# EAGLE design synth-a-phone-v1.2 (EAGLE 5.11)
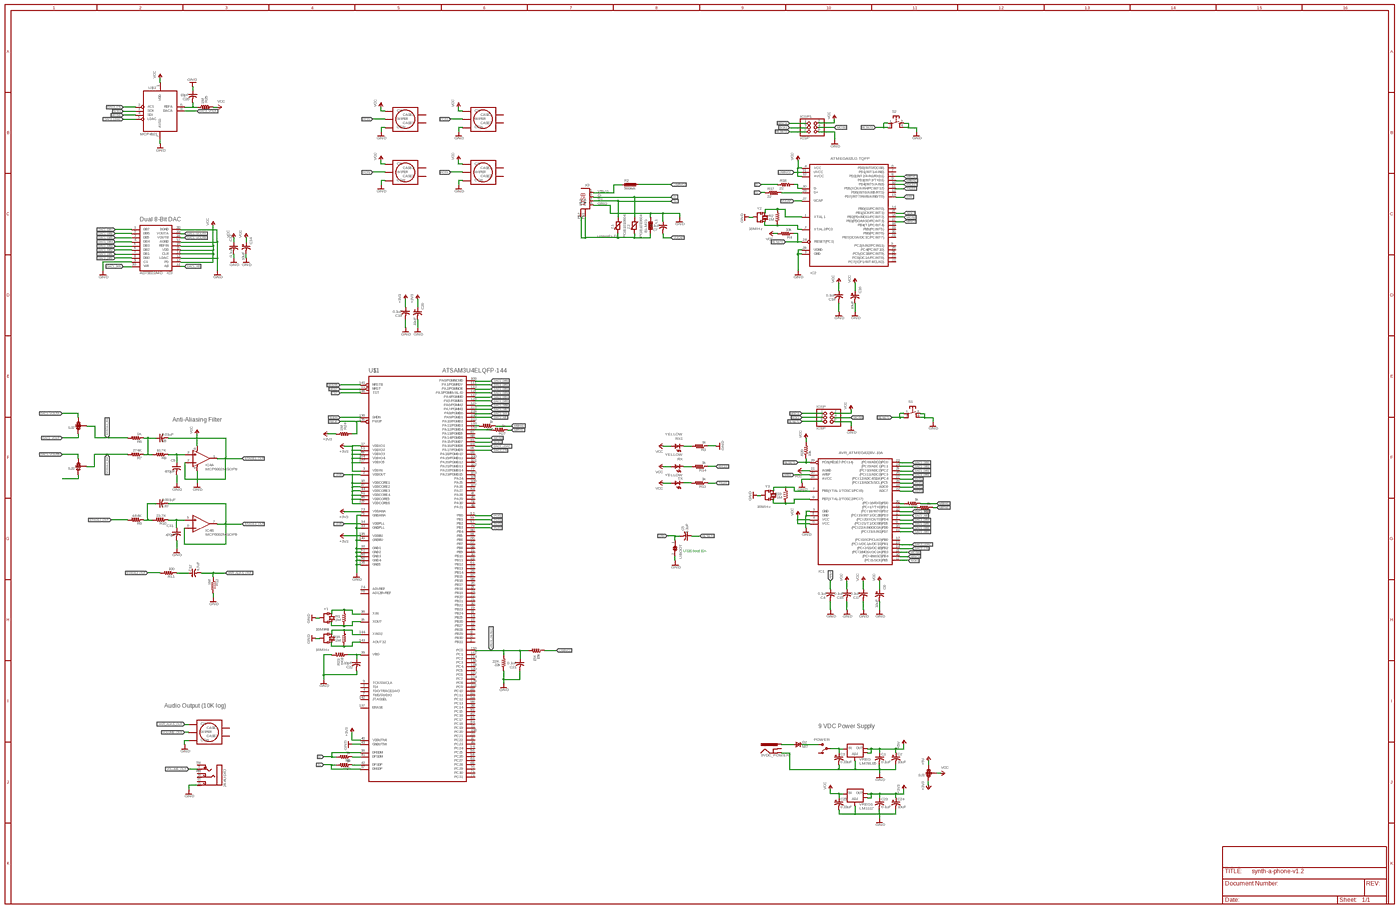
[diagram p0: schematic, sheet 1, overview]
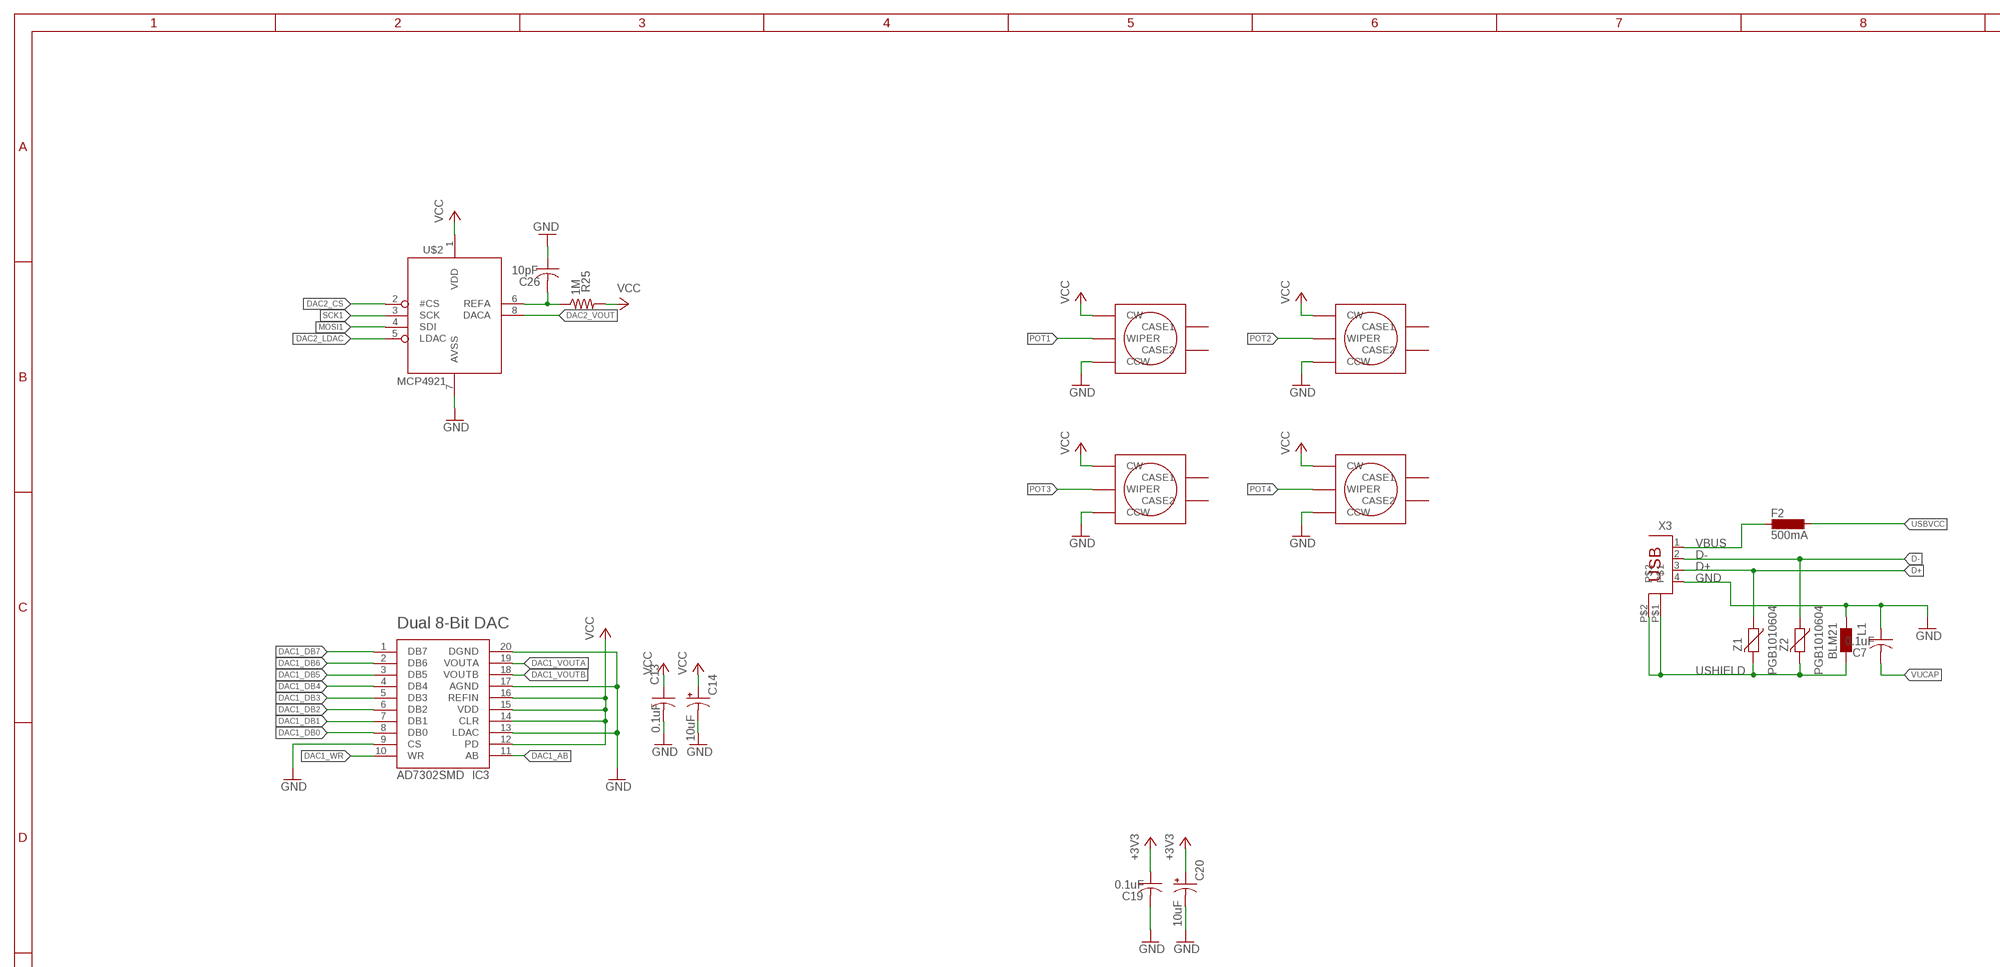
[diagram p1: schematic, sheet 1, part 1 of 4]
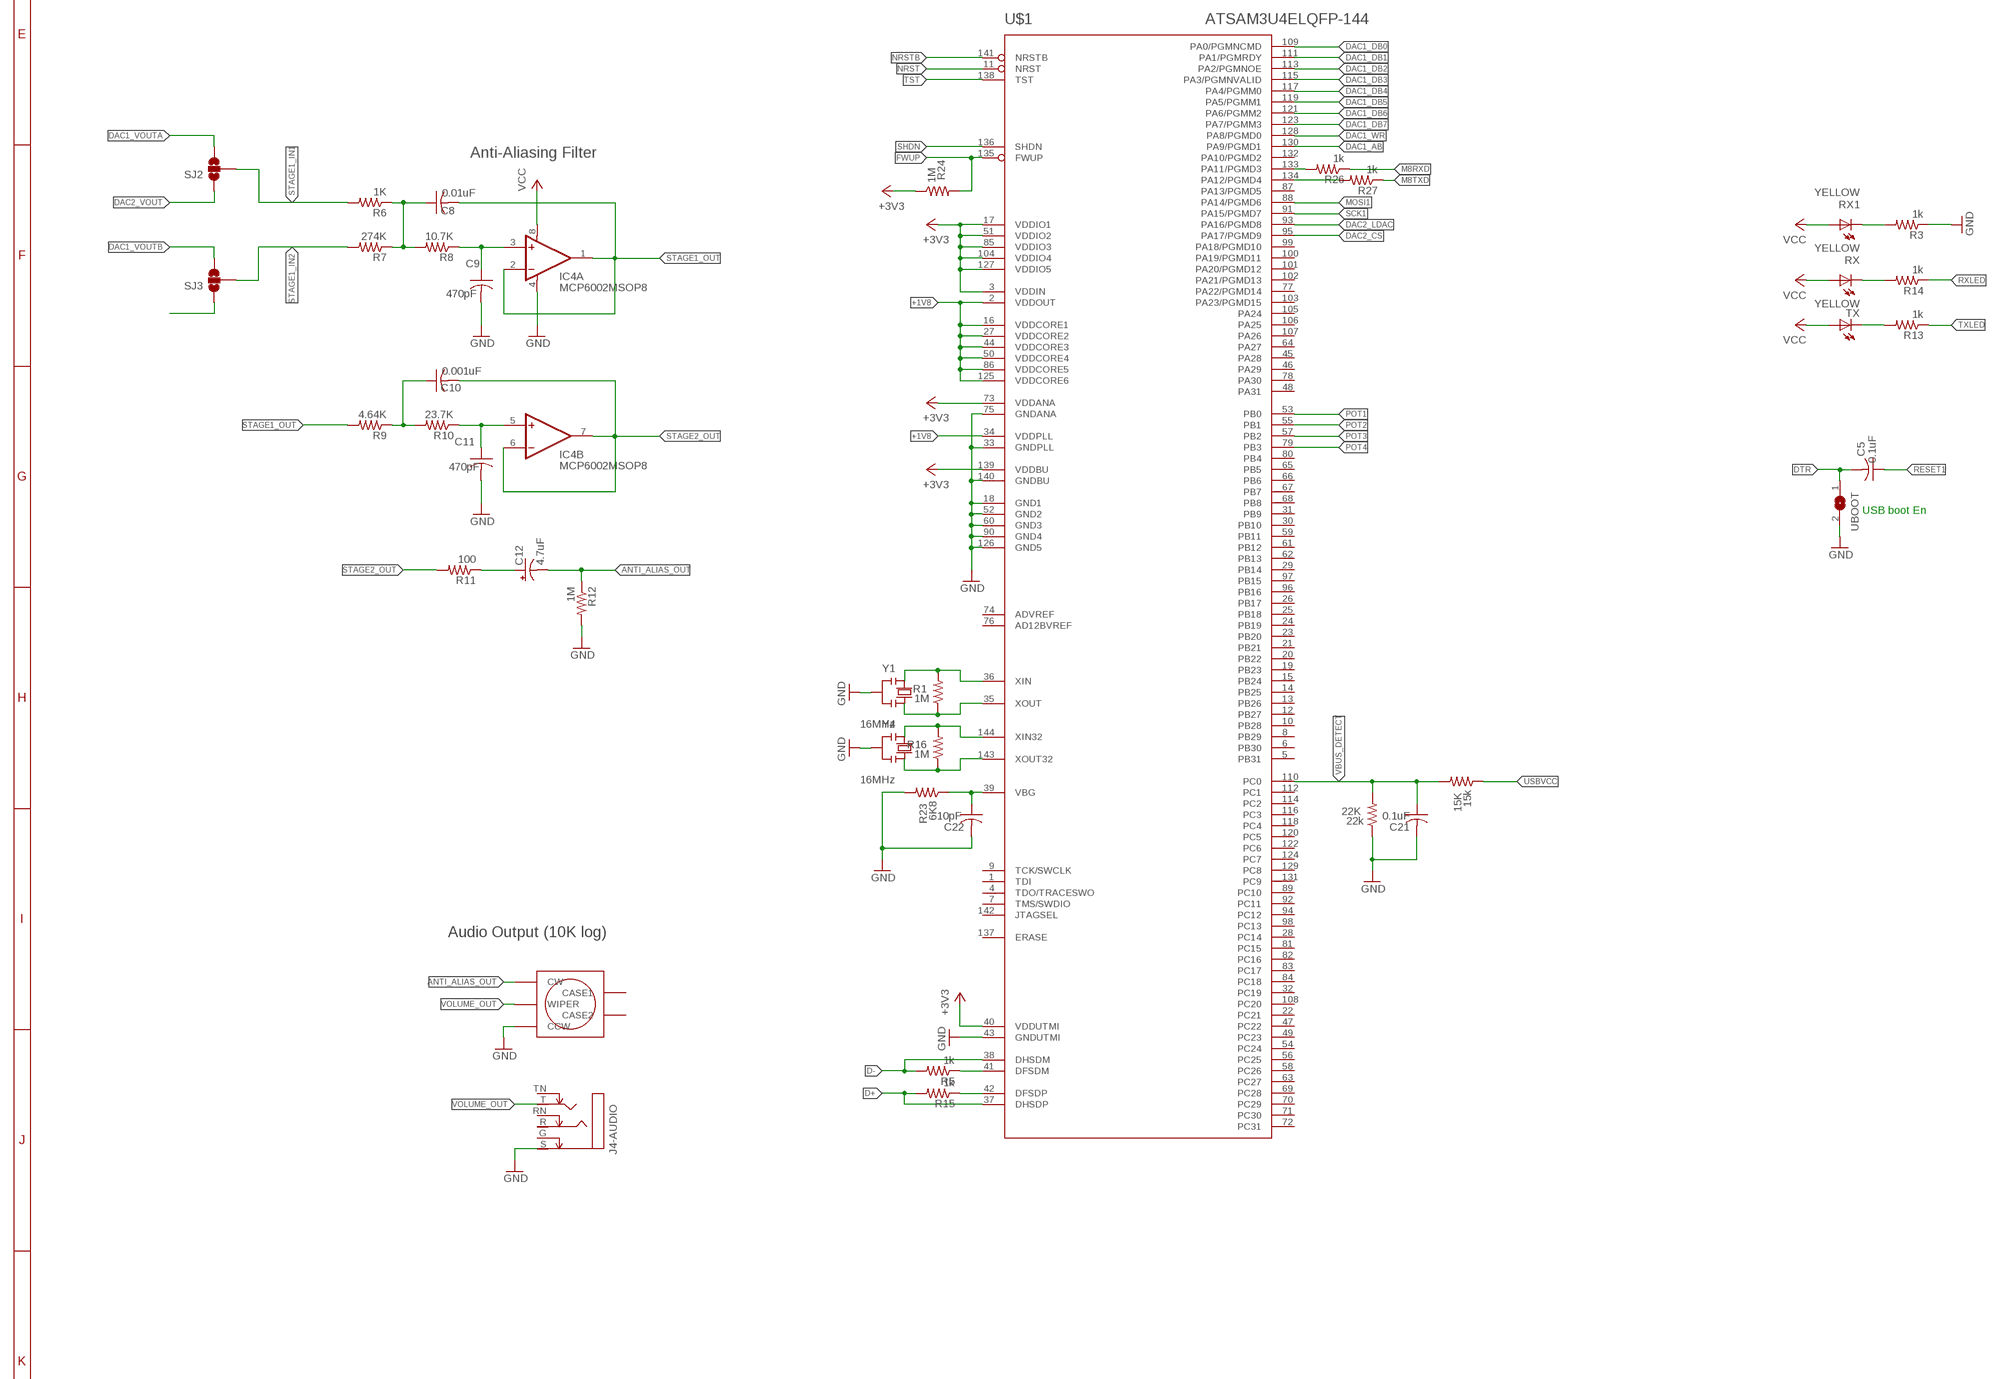
[diagram p2: schematic, sheet 1, part 2 of 4]
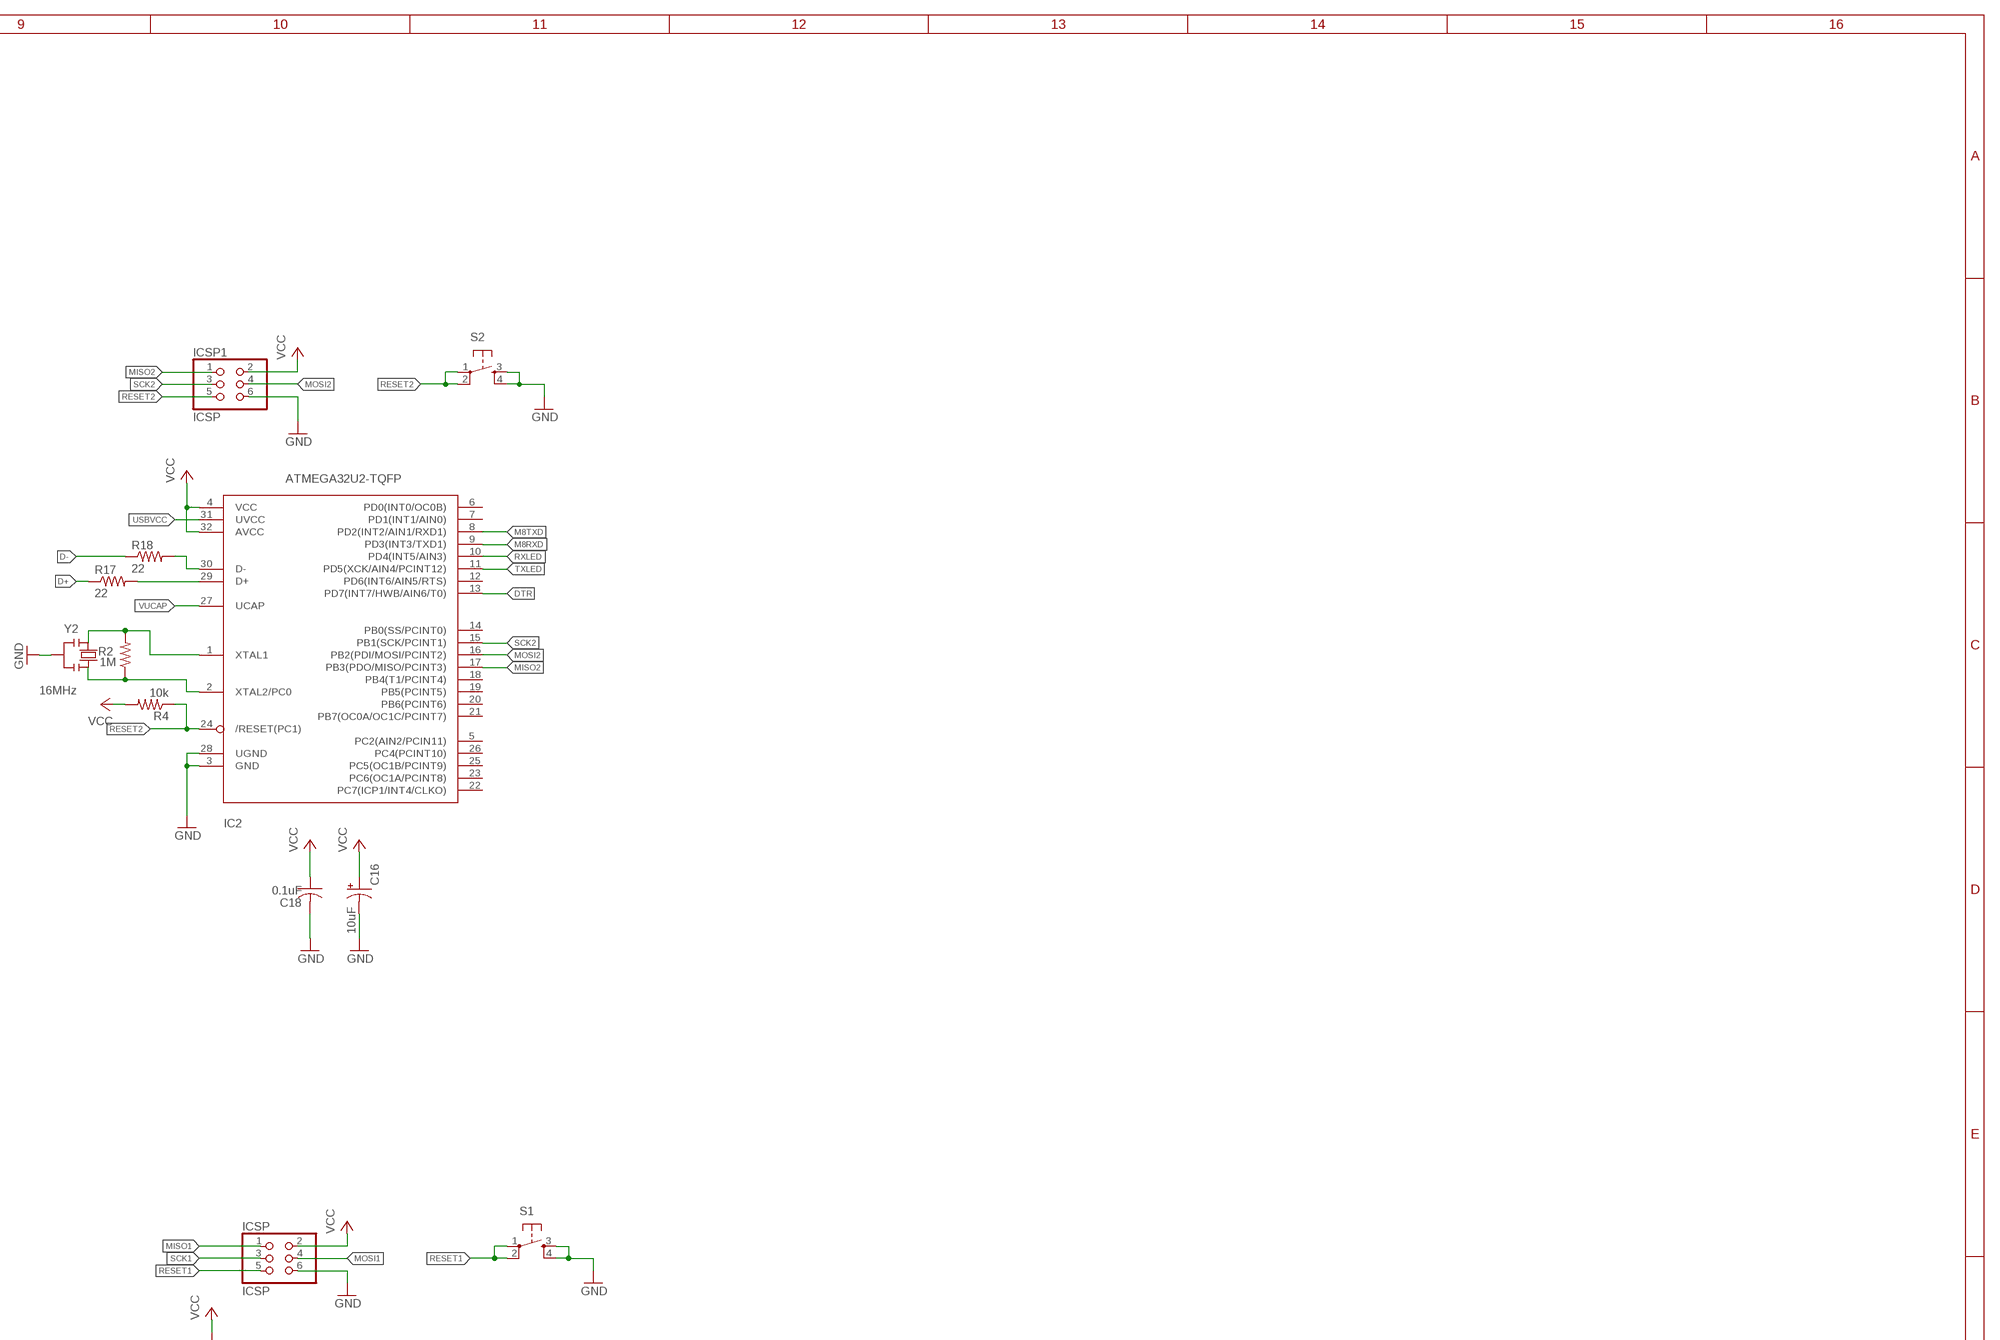
[diagram p3: schematic, sheet 1, part 3 of 4]
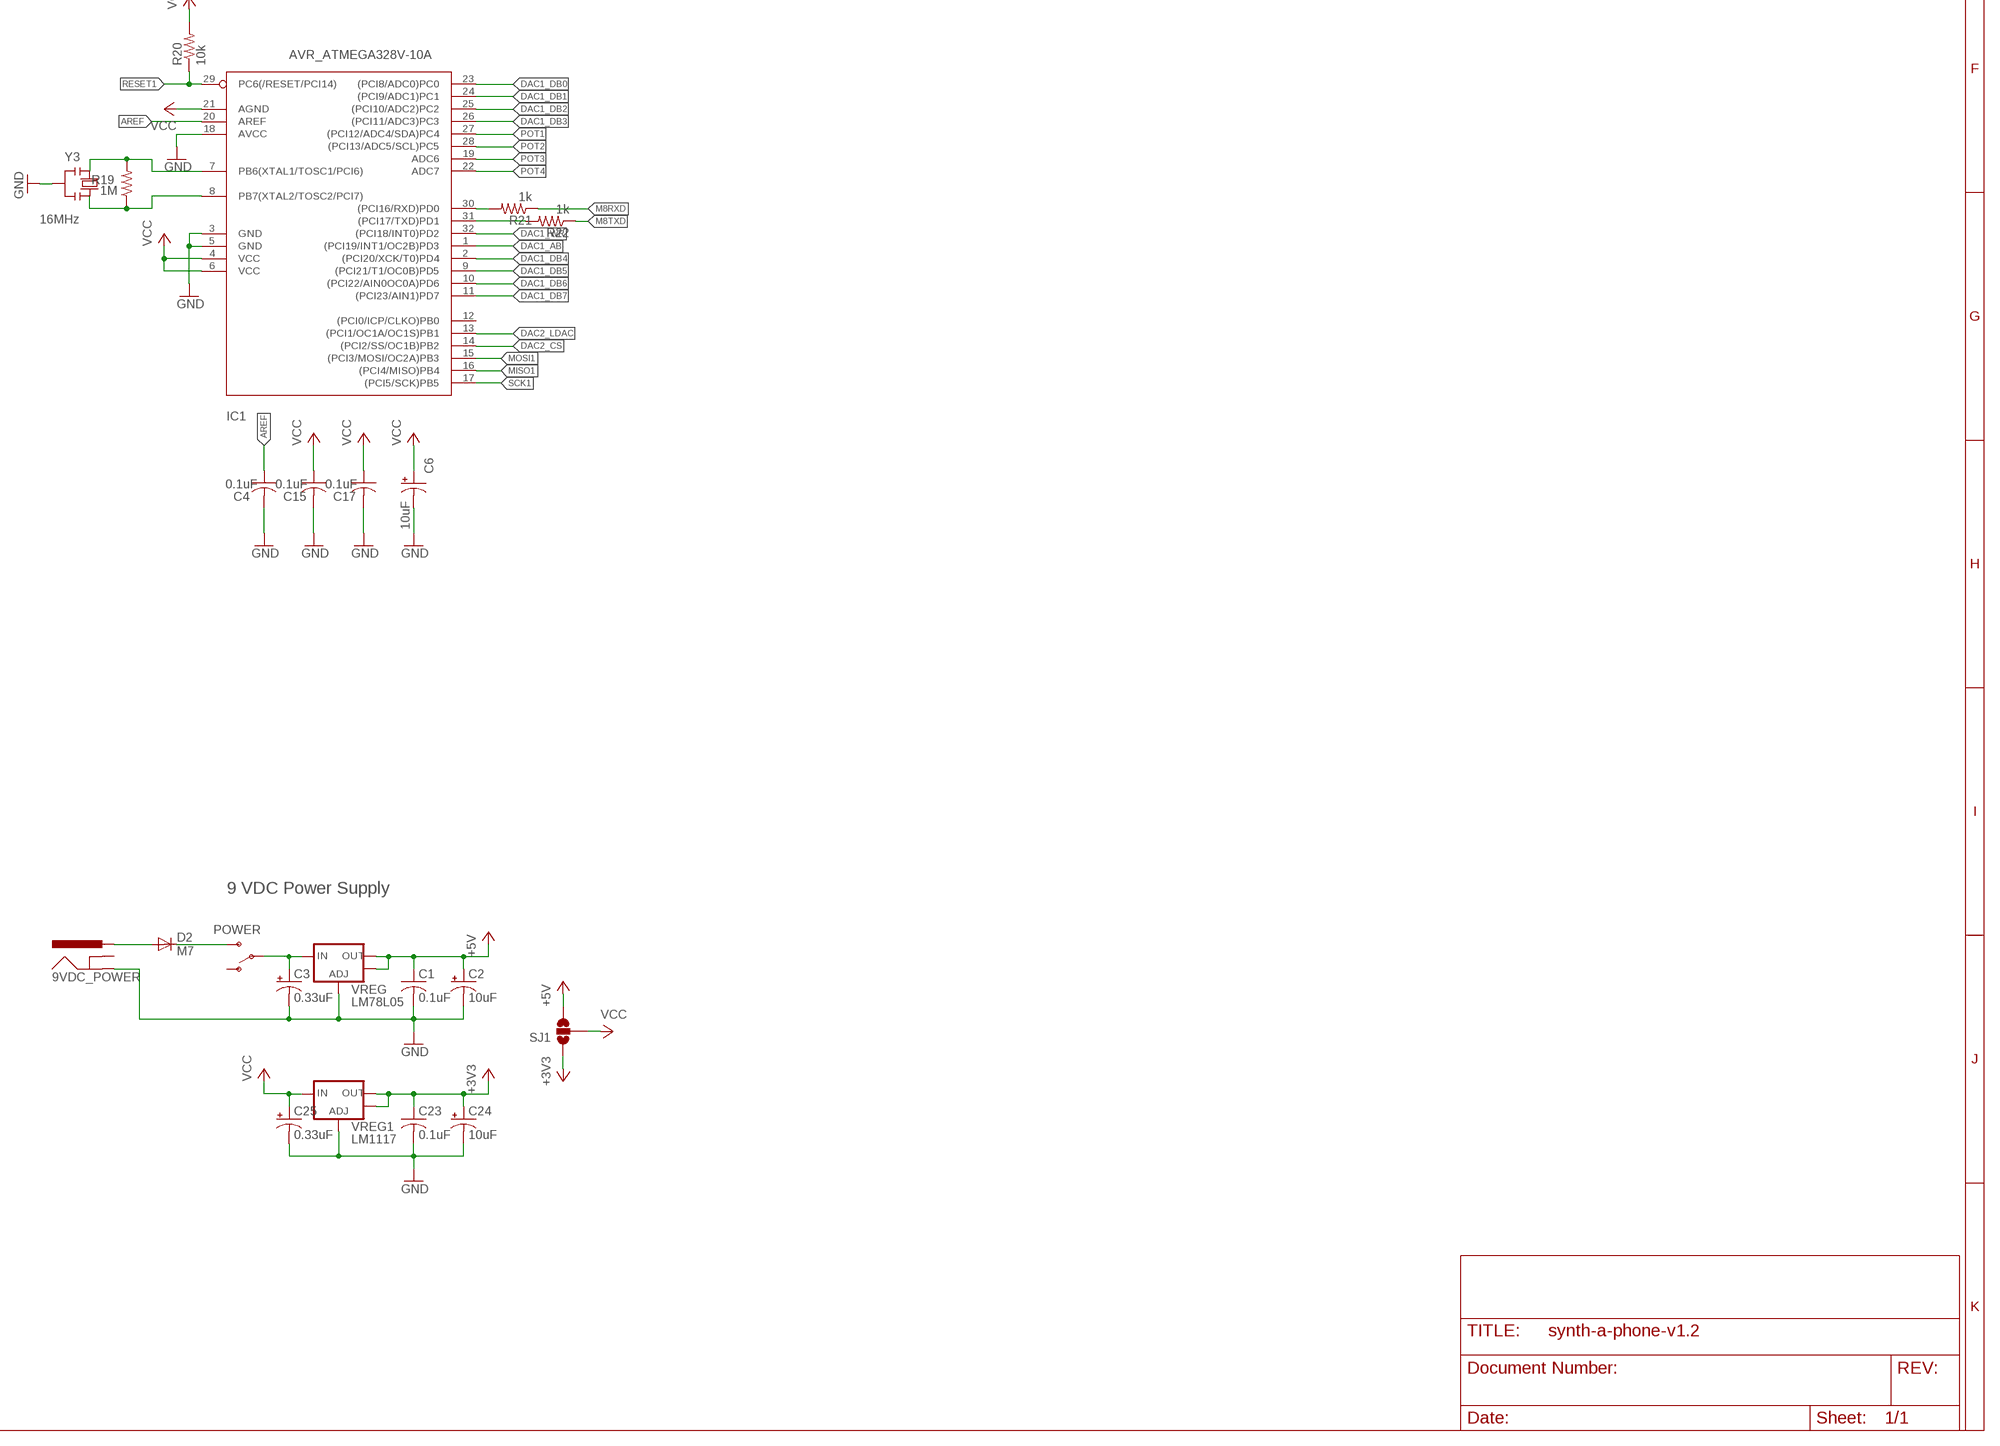
[diagram p4: schematic, sheet 1, part 4 of 4]

## Parts
9VDC_POWER  POWER_JACKPTH  [POWER_JACK_PTH]
15K  15k  R-US_R0603  [R0603]
22K  22k  R-US_R0603  [R0603]
C1  0.1uF  C-USC0603  [C0603]
C2  10uF  CPOL-USSMCA  [SMC_A]
C3  0.33uF  CPOL-USSMCA  [SMC_A]
C4  0.1uF  C-USC0603  [C0603]
C5  0.1uF  C-USC0603  [C0603]
C6  10uF  CPOL-USSMCA  [SMC_A]
C7  0.1uF  C-USC0603  [C0603]
C8  0.01uF  C-USC0603  [C0603]
C9  470pF  C-USC0603  [C0603]
C10  0.001uF  C-USC0603  [C0603]
C11  470pF  C-USC0603  [C0603]
C12  4.7uF  CPOL-USSMCA  [SMC_A]
C13  0.1uF  C-USC0603  [C0603]
C14  10uF  CPOL-USSMCA  [SMC_A]
C15  0.1uF  C-USC0603  [C0603]
C16  10uF  CPOL-USSMCA  [SMC_A]
C17  0.1uF  C-USC0603  [C0603]
C18  0.1uF  C-USC0603  [C0603]
C19  0.1uF  C-USC0603  [C0603]
C20  10uF  CPOL-USSMCA  [SMC_A]
C21  0.1uF  C-USC0603  [C0603]
C22  10pF  C-USC0603  [C0603]
C23  0.1uF  C-USC0603  [C0603]
C24  10uF  CPOL-USSMCA  [SMC_A]
C25  0.33uF  CPOL-USSMCA  [SMC_A]
C26  10pF  C-USC0603  [C0603]
D2  M7  DIODE-SMB  [SMB]
F2  500mA  L-EUL1812  [L1812]
IC1  AVR_ATMEGA328V-10A  [AVR_TQFP32-08]
IC2  ATMEGA32U2-TQFP  [TQFP32-08]
IC3  AD7302SMD  [TSSOP20]
IC4  MCP6002MSOP8  [MSOP8]
ICSP  ICSP  PINHD-2X3  [2X03]
ICSP1  ICSP  PINHD-2X3  [2X03]
J4-AUDIO  STEREOSWL  [NRJ6HF-1]
L1  BLM21  WE-CBF_0805  [0805]
POWER  SPST  SWITCH-SPSTPTH  [SWITCH-SPDT]
R1  1M  R-US_R0603  [R0603]
R2  1M  R-US_R0603  [R0603]
R3  1k  R-US_R0603  [R0603]
R4  10k  R-US_R0603  [R0603]
R5  1k  R-US_R0603  [R0603]
R6  1K  R-US_R0603  [R0603]
R7  274K  R-US_R0603  [R0603]
R8  10.7K  R-US_R0603  [R0603]
R9  4.64K  R-US_R0603  [R0603]
R10  23.7K  R-US_R0603  [R0603]
R11  100  R-US_R0603  [R0603]
R12  1M  R-US_R0603  [R0603]
R13  1k  R-US_R0603  [R0603]
R14  1k  R-US_R0603  [R0603]
R15  1k  R-US_R0603  [R0603]
R16  1M  R-US_R0603  [R0603]
R17  22  R-US_R0603  [R0603]
R18  22  R-US_R0603  [R0603]
R19  1M  R-US_R0603  [R0603]
R20  10k  R-US_R0603  [R0603]
R21  1k  R-US_R0603  [R0603]
R22  1k  R-US_R0603  [R0603]
R23  6K8  R-US_R0603  [R0603]
R24  1M  R-US_R0603  [R0603]
R25  1M  R-US_R0603  [R0603]
R26  1k  R-US_R0603  [R0603]
R27  1k  R-US_R0603  [R0603]
RX  YELLOW  LEDCHIP-LED0805  [CHIP-LED0805]
RX1  YELLOW  LEDCHIP-LED0805  [CHIP-LED0805]
S1  TAC_SWITCHPTH  [TACTILE-PTH]
S2  TAC_SWITCHPTH  [TACTILE-PTH]
SJ1  SOLDERJUMPER_2WAYS  [SJ_3]
SJ2  SOLDERJUMPER_2WAYS  [SJ_3]
SJ3  SOLDERJUMPER_2WAYS  [SJ_3]
TX  YELLOW  LEDCHIP-LED0805  [CHIP-LED0805]
U$1  ATSAM3U4ELQFP-144  [SQFP-S-20X20-144]
U$2  MCP4921MSOP8  [MSOP8]
UBOOT  SJ  [SJ]
VOLUME  Volume  VACOLOCO_EVUFRK09_POT  [VACOLOCO_EVUF]
VOLUME1  Volume  VACOLOCO_EVUFRK09_POT  [VACOLOCO_EVUF]
VOLUME2  Volume  VACOLOCO_EVUFRK09_POT  [VACOLOCO_EVUF]
VOLUME3  Volume  VACOLOCO_EVUFRK09_POT  [VACOLOCO_EVUF]
VOLUME4  Volume  VACOLOCO_EVUFRK09_POT  [VACOLOCO_EVUF]
VREG  LM78L05  V_REG_LM1117SOT223  [SOT223]
VREG1  LM1117  V_REG_LM1117SOT223  [SOT223]
X3  PN61729  [PN61729]
Y1  16MHz  RESONATORMU  [RESONATOR]
Y2  16MHz  RESONATORMU  [RESONATOR]
Y3  16MHz  RESONATORMU  [RESONATOR]
Y4  16MHz  RESONATORMU  [RESONATOR]
Z1  PGB1010604  VARISTORCN0603  [CT/CN0603]
Z2  PGB1010604  VARISTORCN0603  [CT/CN0603]

## Nets
+1V8: U$1.2(VDDOUT) U$1.16(VDDCORE1) U$1.27(VDDCORE2) U$1.34(VDDPLL) U$1.44(VDDCORE3) U$1.50(VDDCORE4) U$1.86(VDDCORE5) U$1.125(VDDCORE6)
+3V3: C19.1 C20.+ C23.1 C24.+ R24.1 SJ1.1 U$1.3(VDDIN) U$1.17(VDDIO1) U$1.40(VDDUTMI) U$1.51(VDDIO2) U$1.73(VDDANA) U$1.85(VDDIO3) U$1.104(VDDIO4) U$1.127(VDDIO5) U$1.139(VDDBU) VREG1.2(OUT) VREG1.4(OUT)
+5V: C1.1 C2.+ SJ1.3 VREG.2(OUT) VREG.4(OUT)
ANTI_ALIAS_OUT: C12.- R12.1 VOLUME.CW
AREF: C4.1 IC1.20(AREF)
D+: R15.2 R17.1 U$1.37(DHSDP) X3.3 Z1.1
D-: R5.2 R18.1 U$1.38(DHSDM) X3.2 Z2.1
DAC1_AB: IC1.1((PCI19/INT1/OC2B)PD3) IC3.11(AB) U$1.130(PA9/PGMD1)
DAC1_DB0: IC1.23((PCI8/ADC0)PC0) IC3.8(DB0) U$1.109(PA0/PGMNCMD)
DAC1_DB1: IC1.24((PCI9/ADC1)PC1) IC3.7(DB1) U$1.111(PA1/PGMRDY)
DAC1_DB2: IC1.25((PCI10/ADC2)PC2) IC3.6(DB2) U$1.113(PA2/PGMNOE)
DAC1_DB3: IC1.26((PCI11/ADC3)PC3) IC3.5(DB3) U$1.115(PA3/PGMNVALID)
DAC1_DB4: IC1.2((PCI20/XCK/T0)PD4) IC3.4(DB4) U$1.117(PA4/PGMM0)
DAC1_DB5: IC1.9((PCI21/T1/OC0B)PD5) IC3.3(DB5) U$1.119(PA5/PGMM1)
DAC1_DB6: IC1.10((PCI22/AIN0OC0A)PD6) IC3.2(DB6) U$1.121(PA6/PGMM2)
DAC1_DB7: IC1.11((PCI23/AIN1)PD7) IC3.1(DB7) U$1.123(PA7/PGMM3)
DAC1_VOUTA: IC3.19(VOUTA) SJ2.3
DAC1_VOUTB: IC3.18(VOUTB) SJ3.3
DAC1_WR: IC1.32((PCI18/INT0)PD2) IC3.10(WR) U$1.128(PA8/PGMD0)
DAC2_CS: IC1.14((PCI2/SS/OC1B)PB2) U$1.95(PA17/PGMD9) U$2.2(#CS)
DAC2_LDAC: IC1.13((PCI1/OC1A/OC1S)PB1) U$1.93(PA16/PGMD8) U$2.5(LDAC)
DAC2_VOUT: SJ2.1 U$2.8(DACA)
DTR: C5.2 IC2.13(PD7(INT7/HWB/AIN6/T0)) UBOOT.1
FWUP: R24.2 U$1.135(FWUP)
GND: 9VDC_POWER.GND 22K.1 C1.2 C2.- C3.- C4.2 C6.- C7.1 C9.2 C11.2 C13.2 C14.- C15.2 C16.- C17.2 C18.2 C19.2 C20.- C21.2 C22.2 C23.2 C24.- C25.- C26.1 IC1.3(GND) IC1.5(GND) IC1.18(AVCC) IC2.3(GND) IC2.28(UGND) IC3.9(CS) IC3.13(LDAC) IC3.17(AGND) IC3.20(DGND) IC4.4(A:V-) ICSP1.6 ICSP.6 J4-AUDIO.S L1.1 R3.1 R12.2 R23.2 S1.3 S1.4 S2.3 S2.4 U$1.18(GND1) U$1.33(GNDPLL) U$1.43(GNDUTMI) U$1.52(GND2) U$1.60(GND3) U$1.75(GNDANA) U$1.90(GND4) U$1.126(GND5) U$1.140(GNDBU) U$2.7(AVSS) UBOOT.2 VOLUME1.CCW VOLUME2.CCW VOLUME3.CCW VOLUME4.CCW VOLUME.CCW VREG1.1(ADJ) VREG.1(ADJ) X3.4 Y1.2 Y2.2 Y3.2 Y4.2
M8RXD: IC2.9(PD3(INT3/TXD1)) R21.1 R26.1
M8TXD: IC2.8(PD2(INT2/AIN1/RXD1)) R22.1 R27.1
MISO1: IC1.16((PCI4/MISO)PB4) ICSP.1
MISO2: IC2.17(PB3(PDO/MISO/PCINT3)) ICSP1.1
MOSI1: IC1.15((PCI3/MOSI/OC2A)PB3) ICSP.4 U$1.88(PA14/PGMD6) U$2.4(SDI)
MOSI2: IC2.16(PB2(PDI/MOSI/PCINT2)) ICSP1.4
N$1: R5.1 U$1.41(DFSDM)
N$2: R15.1 U$1.42(DFSDP)
N$3: R14.2 RX.C
N$4: R13.2 TX.C
N$5: C22.1 R23.1 U$1.39(VBG)
N$6: R3.2 RX1.C
N$7: R26.2 U$1.133(PA11/PGMD3)
N$8: IC1.30((PCI16/RXD)PD0) R21.2
N$9: IC1.31((PCI17/TXD)PD1) R22.2
N$10: R27.2 U$1.134(PA12/PGMD4)
N$12: SJ3.1
N$15: C26.2 R25.1 U$2.6(REFA)
N$21: C12.+ R11.1
N$25: 9VDC_POWER.PWR D2.A
N$27: C3.+ POWER.2(P) VREG.3(IN)
N$42: D2.C POWER.3(S)
N$69: C8.1 R6.1 R7.1 R8.2
N$71: C9.1 IC4.3(A:+IN) R8.1
N$73: C10.1 R9.1 R10.2
N$74: C11.1 IC4.5(B:+IN) R10.1
NRST: U$1.11(NRST)
NRSTB: U$1.141(NRSTB)
POT1: IC1.27((PCI12/ADC4/SDA)PC4) U$1.53(PB0) VOLUME4.WIPER
POT2: IC1.28((PCI13/ADC5/SCL)PC5) U$1.55(PB1) VOLUME2.WIPER
POT3: IC1.19(ADC6) U$1.57(PB2) VOLUME3.WIPER
POT4: IC1.22(ADC7) U$1.79(PB3) VOLUME1.WIPER
RD+: IC2.29(D+) R17.2
RD-: IC2.30(D-) R18.2
RESET1: C5.1 IC1.29(PC6(/RESET/PCI14)) ICSP.5 R20.1 S1.1 S1.2
RESET2: IC2.24(/RESET(PC1)) ICSP1.5 R4.1 S2.1 S2.2
RXLED: IC2.10(PD4(INT5/AIN3)) R14.1
SCK1: IC1.17((PCI5/SCK)PB5) ICSP.3 U$1.91(PA15/PGMD7) U$2.3(SCK)
SCK2: IC2.15(PB1(SCK/PCINT1)) ICSP1.3
SHDN: U$1.136(SHDN)
STAGE1_IN1: R6.2 SJ2.2
STAGE1_IN2: R7.2 SJ3.2
STAGE1_OUT: C8.2 IC4.1(A:OUT) IC4.2(A:-IN) R9.2
STAGE2_OUT: C10.2 IC4.6(B:-IN) IC4.7(B:OUT) R11.2
TST: U$1.138(TST)
TXLED: IC2.11(PD5(XCK/AIN4/PCINT12)) R13.1
USBVCC: 15K.1 F2.1 IC2.31(UVCC)
USHIELD: L1.2 X3.P$1 X3.P$2 Z1.2 Z2.2
VBUS: F2.2 X3.1
VBUS_DETECT: 15K.2 22K.2 C21.1 U$1.110(PC0)
VCC: C6.+ C13.1 C14.+ C15.1 C16.+ C17.1 C18.1 C25.+ IC1.4(VCC) IC1.6(VCC) IC1.21(AGND) IC2.4(VCC) IC2.32(AVCC) IC3.12(PD) IC3.14(CLR) IC3.15(VDD) IC3.16(REFIN) IC4.8(A:V+) ICSP1.2 ICSP.2 R4.2 R20.2 R25.2 RX1.A RX.A SJ1.2 TX.A VOLUME1.CW VOLUME2.CW VOLUME3.CW VOLUME4.CW VREG1.3(IN)
VDD: U$2.1(VDD) ; supply symbol labelled VCC
VOLUME_OUT: J4-AUDIO.T VOLUME.WIPER
VUCAP: C7.2 IC2.27(UCAP)
XTAL1: IC2.1(XTAL1) R2.2 Y2.1
XTAL2: IC2.2(XTAL2/PC0) R2.1 Y2.3
XTAL3: R1.2 U$1.36(XIN) Y1.1
XTAL4: R1.1 U$1.35(XOUT) Y1.3
XTAL5: IC1.7(PB6(XTAL1/TOSC1/PCI6)) R19.2 Y3.1
XTAL6: IC1.8(PB7(XTAL2/TOSC2/PCI7)) R19.1 Y3.3
XTAL7: R16.2 U$1.144(XIN32) Y4.1
XTAL8: R16.1 U$1.143(XOUT32) Y4.3
Unconnected: 9VDC_POWER.GNDBREAK IC1.12((PCI0/ICP/CLKO)PB0) IC2.5(PC2(AIN2/PCIN11)) IC2.6(PD0(INT0/OC0B)) IC2.7(PD1(INT1/AIN0)) IC2.12(PD6(INT6/AIN5/RTS)) IC2.14(PB0(SS/PCINT0)) IC2.18(PB4(T1/PCINT4)) IC2.19(PB5(PCINT5)) IC2.20(PB6(PCINT6)) IC2.21(PB7(OC0A/OC1C/PCINT7)) IC2.22(PC7(ICP1/INT4/CLKO)) IC2.23(PC6(OC1A/PCINT8)) IC2.25(PC5(OC1B/PCINT9)) IC2.26(PC4(PCINT10)) J4-AUDIO.G(SN) J4-AUDIO.R J4-AUDIO.RN J4-AUDIO.TN POWER.1(O) U$1.1(TDI) U$1.4(TDO/TRACESWO) U$1.5(PB31) U$1.6(PB30) U$1.7(TMS/SWDIO) U$1.8(PB29) U$1.9(TCK/SWCLK) U$1.10(PB28) U$1.12(PB27) U$1.13(PB26) U$1.14(PB25) U$1.15(PB24) U$1.19(PB23) U$1.20(PB22) U$1.21(PB21) U$1.22(PC21) U$1.23(PB20) U$1.24(PB19) U$1.25(PB18) U$1.26(PB17) U$1.28(PC14) U$1.29(PB14) U$1.30(PB10) U$1.31(PB9) U$1.32(PC19) U$1.45(PA28) U$1.46(PA29) U$1.47(PC22) U$1.48(PA31) U$1.49(PC23) U$1.54(PC24) U$1.56(PC25) U$1.58(PC26) U$1.59(PB11) U$1.61(PB12) U$1.62(PB13) U$1.63(PC27) U$1.64(PA27) U$1.65(PB5) U$1.66(PB6) U$1.67(PB7) U$1.68(PB8) U$1.69(PC28) U$1.70(PC29) U$1.71(PC30) U$1.72(PC31) U$1.74(ADVREF) U$1.76(AD12BVREF) U$1.77(PA22/PGMD14) U$1.78(PA30) U$1.80(PB4) U$1.81(PC15) U$1.82(PC16) U$1.83(PC17) U$1.84(PC18) U$1.87(PA13/PGMD5) U$1.89(PC10) U$1.92(PC11) U$1.94(PC12) U$1.96(PB16) U$1.97(PB15) U$1.98(PC13) U$1.99(PA18/PGMD10) U$1.100(PA19/PGMD11) U$1.101(PA20/PGMD12) U$1.102(PA21/PGMD13) U$1.103(PA23/PGMD15) U$1.105(PA24) U$1.106(PA25) U$1.107(PA26) U$1.108(PC20) U$1.112(PC1) U$1.114(PC2) U$1.116(PC3) U$1.118(PC4) U$1.120(PC5) U$1.122(PC6) U$1.124(PC7) U$1.129(PC8) U$1.131(PC9) U$1.132(PA10/PGMD2) U$1.137(ERASE) U$1.142(JTAGSEL) VOLUME1.CASE1 VOLUME1.CASE2 VOLUME2.CASE1 VOLUME2.CASE2 VOLUME3.CASE1 VOLUME3.CASE2 VOLUME4.CASE1 VOLUME4.CASE2 VOLUME.CASE1 VOLUME.CASE2

## Notes on the sheet
- Dual 8-Bit DAC
- Anti-Aliasing Filter
- USB boot En
- Audio Output (10K log)
- 9 VDC Power Supply

## Library data of the parts
9VDC_POWER = meeblip:POWER_JACK: Power Jack 5.5mm barrel jack for optional 9 VDC power input.
15K 22K R1-R27 = rcl:R-US_: RESISTOR, American symbol
C1 C4 C5 C7-C11 C13 C15 C17-C19 C21-C23 C26 = rcl:C-US: CAPACITOR, American symbol
C2 C3 C6 C12 C14 C16 C20 C24 C25 = rcl:CPOL-US: POLARIZED CAPACITOR, American symbol
D2 = diode:DIODE-: DIODE
F2 = rcl:L-EU: INDUCTOR, European symbol
IC1 = avr:AVR_ATMEGA328: MICROCONTROLLER 32 kBytes FLASH 1 kBytes SRAM 512 Bytes EEPROM USART 8-channel 10 bit ADC
IC2 = adafruit:ATMEGA32U2: ATmega32u2 Pin compatible with the atmega8u2, atmega16u2 and atmega32u2 8, 16 or 32 K flash, 1K RAM, 512b EEPROM 8 bit and 16 bit timer (5 PWM total) UART, SPI (no I2C!) USB with 4 endpoints, LUFA compatible 22 I/O lines, analog comparator (no ADC!) Comes with DFU bootloader burned in!
IC3 = SparkFun:AD7302: AD7302
IC4 = Sparky:MCP6002: Dual Op Amp
ICSP ICSP1 = pinhead:PINHD-2X3: PIN HEADER
J4-AUDIO = meeblip:STEREOSW: Neutrik Stereo 1/4" Jack Easy to obtain. The mono version is used in MeeBilp, it shares the same pinout.
L1 = wuerth-elektronik:WE-CBF: SMD EMI Suppression Ferrite Beads - excellent anti-EMI properties - low DCR - impedances till 3000 ohms - rated current up to 6 A
POWER = meeblip:SWITCH-SPST: SPDT Switch ON-ON slide switch. Mouser part #102-1221-EV
RX RX1 TX = led:LED: LED OSRAM: - CHIPLED LG R971, LG N971, LY N971, LG Q971, LY Q971, LO R971, LY R971 LH N974, LH R974 LS Q976, LO Q976, LY Q976 LO Q996 - Hyper CHIPLED LW Q18S LB Q993, LB Q99A, LB R99A - SideLED LS A670, LO A670, LY A670, LG A670, LP A670 LB A673, LV A673, LT A673, LW A673 LH A674 LY A675 LS A676, LA A676, LO A676, LY A676, LW A676 LS A679, LY A679, LG A679 - Hyper Micro SIDELED® LS Y876, LA Y876, LO Y876, LY Y876 LT Y87S - SmartLED LW L88C, LW L88S LB L89C, LB L89S, LG L890 LS L89K, LO L89K, LY L89K LS L896, LA L896, LO L896, LY L896 - TOPLED LS T670, LO T670, LY T670, LG T670, LP T670 LSG T670, LSP T670, LSY T670, LOP T670, LYG T670 LG T671, LOG T671, LSG T671 LB T673, LV T673, LT T673, LW T673 LH T674 LS T676, LA T676, LO T676, LY T676, LB T676, LH T676, LSB T676, LW T676 LB T67C, LV T67C, LT T67C, LS T67K, LO T67K, LY T67K, LW E67C LS E67B, LA E67B, LO E67B, LY E67B, LB E67C, LV E67C, LT E67C LW T67C LS T679, LY T679, LG T679 LS T770, LO T770, LY T770, LG T770, LP T770 LB T773, LV T773, LT T773, LW T773 LH T774 LS E675, LA E675, LY E675, LS T675 LS T776, LA T776, LO T776, LY T776, LB T776 LHGB T686 LT T68C, LB T68C - Hyper Mini TOPLED® LB M676 - Mini TOPLED Santana® LG M470 LS M47K, LO M47K, LY M47K Source: http://www.osram.convergy.de LUXEON: - LUMILED® LXK2-PW12-R00, LXK2-PW12-S00, LXK2-PW14-U00, LXK2-PW14-V00 LXK2-PM12-R00, LXK2-PM12-S00, LXK2-PM14-U00 LXK2-PE12-Q00, LXK2-PE12-R00, LXK2-PE12-S00, LXK2-PE14-T00, LXK2-PE14-U00 LXK2-PB12-K00, LXK2-PB12-L00, LXK2-PB12-M00, LXK2-PB14-N00, LXK2-PB14-P00, LXK2-PB14-Q00 LXK2-PR12-L00, LXK2-PR12-M00, LXK2-PR14-Q00, LXK2-PR14-R00 LXK2-PD12-Q00, LXK2-PD12-R00, LXK2-PD12-S00 LXK2-PH12-R00, LXK2-PH12-S00 LXK2-PL12-P00, LXK2-PL12-Q00, LXK2-PL12-R00 Source: www.luxeon.com KINGBRIGHT: KA-3528ASYC Source: www.kingbright.com
S1 S2 = SparkFun:TAC_SWITCH: Momentary Switch Button commonly used for reset or general input. Spark Fun Electronics SKU : COM-00097
SJ1-SJ3 = SparkFun:SOLDERJUMPER_2WAY: Solder Jumper 2 way solder jumper
U$1 = Sparky:ATSAM3U4E
U$2 = Sparky:MCP4921
UBOOT = jumper:SJ: SMD solder JUMPER
VOLUME VOLUME1-VOLUME4 = meeblip:VACOLOCO_EVUF: Panasonic EVUF type potentionmeter Vertical Mount
VREG VREG1 = SparkFun:V_REG_LM1117: Voltage Regulator LM1117 Standard adjustable voltage regulator but in SMD form. Spark Fun Electronics SKU : COM-00595
X3 = SmartPrj:PN61729: BERG USB connector
Y1-Y4 = SmartPrj:RESONATOR
Z1 Z2 = varistor:VARISTOR: VARISTOR

## Board
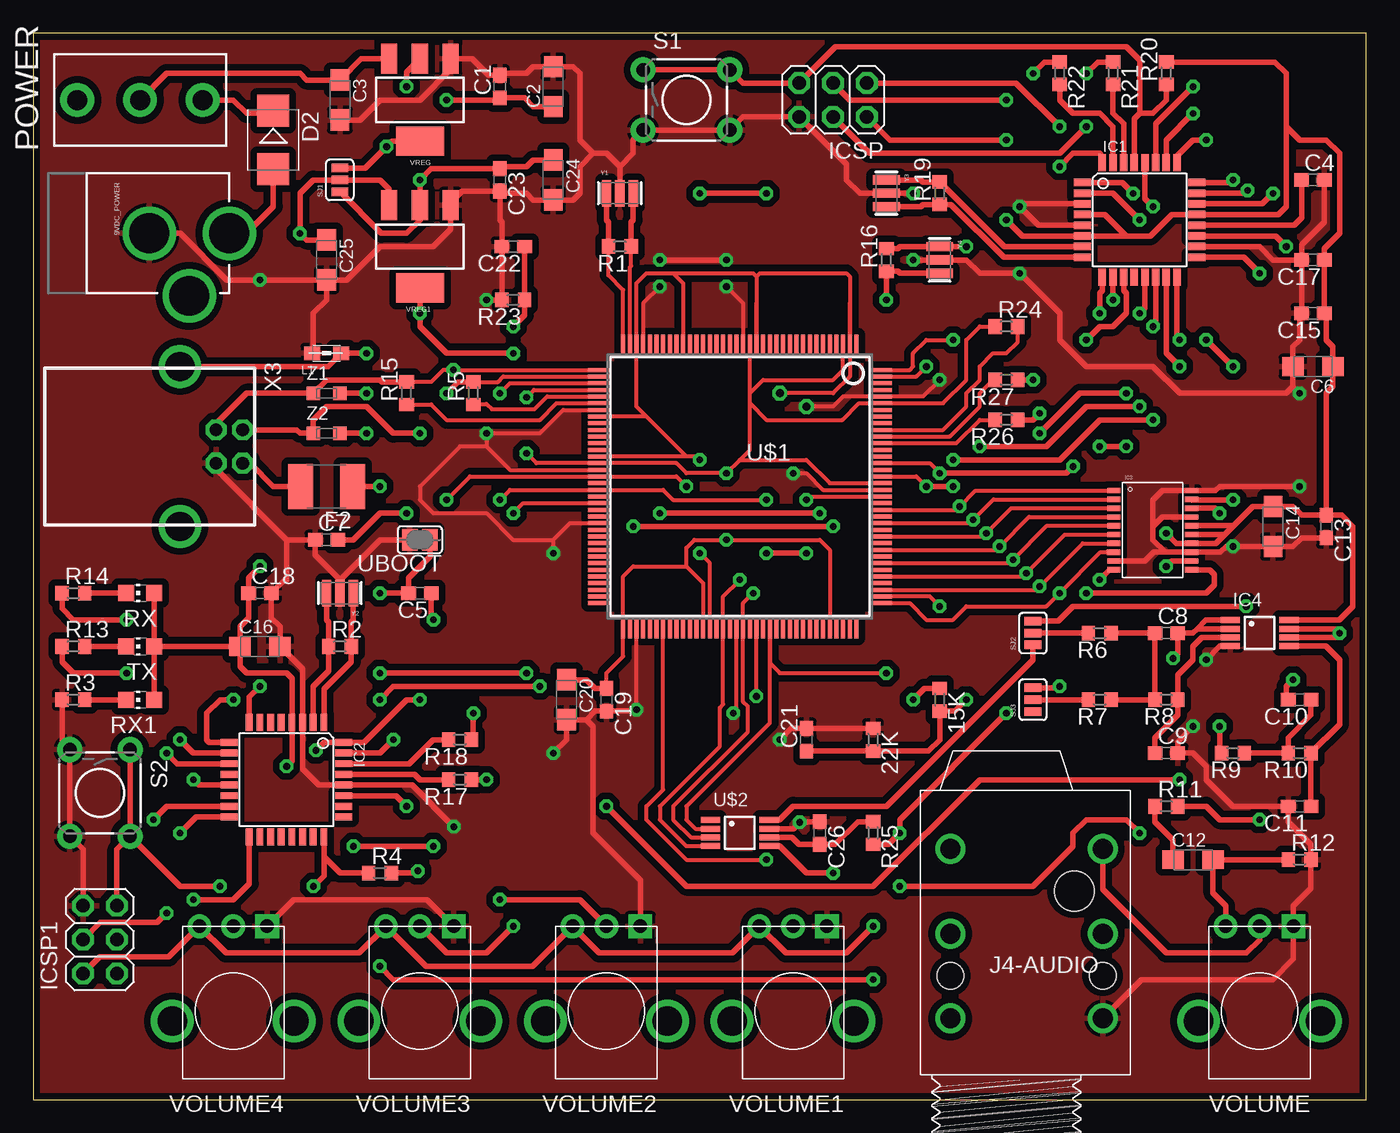
[diagram p5: board, top side]
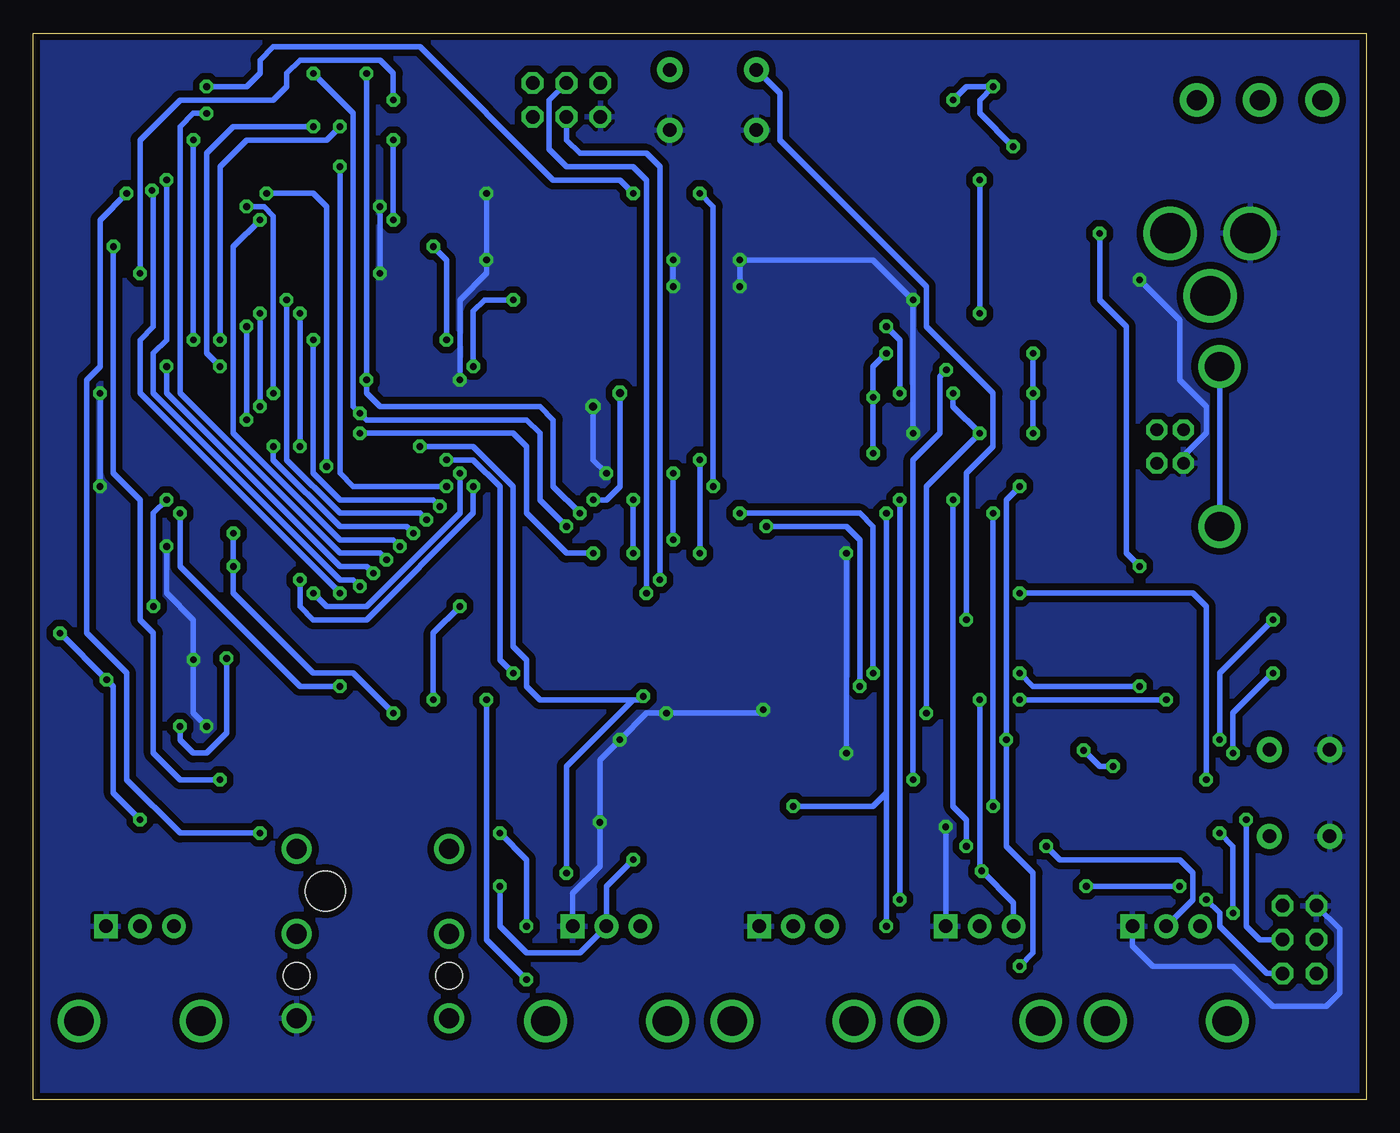
[diagram p6: board, bottom side, seen from below]

Size 100 x 80 mm. Coordinates in mm from the lower left corner, seen from the top.
Outline: 0,0 100,0 100,80 0,80 0,0
Copper layers (1*16): Top 0.035mm / dielectric 1.5mm / Bottom 0.035mm
Design rules "APC *": minimum track width 7mil, minimum drill 15mil, track to track 7mil, track to pad 7mil, pad to pad 7mil, via to via 7mil, smd to smd 1mil, copper to edge 8mil, drill to drill 8mil, minimum pad ring 12mil, minimum via ring 10mil, stop-mask expansion 4mil, vias tented up to drill 25mil, thermal gap 10mil

### Footprints (pad centres in the part's own frame; a part is rotated, then mirrored left to right if it is on the bottom)
POWER_JACK_PTH = drill 2.997 round: GND 0,7.7; GNDBREAK 4.7,10.7; PWR 0,13.7
R0603 = smd 1 x 1.1: 1 -0.85,0; 2 0.85,0
C0603 = smd 1.1 x 1: 1 -0.85,0; 2 0.85,0
SMC_A = smd 1.6 x 1.4: + -1.5,0; - 1.5,0
SMB = smd 2.4 x 2.4: A 2.2,0; C -2.2,0
L1812 = smd 1.9 x 3.4: 1 -1.95,0; 2 1.95,0
AVR_TQFP32-08 = smd 1.27 x 0.559: 1 -4.293,2.8; 2 -4.293,2; 3 -4.293,1.2; 4 -4.293,0.4; 5 -4.293,-0.4; 6 -4.293,-1.2; 7 -4.293,-2; 8 -4.293,-2.8; 17 4.293,-2.8; 18 4.293,-2; 19 4.293,-1.2; 20 4.293,-0.4; 21 4.293,0.4; 22 4.293,1.2; 23 4.293,2; 24 4.293,2.8 | smd 0.559 x 1.27: 9 -2.8,-4.293; 10 -2,-4.293; 11 -1.2,-4.293; 12 -0.4,-4.293; 13 0.4,-4.293; 14 1.2,-4.293; 15 2,-4.293; 16 2.8,-4.293; 25 2.8,4.293; 26 2,4.293; 27 1.2,4.293; 28 0.4,4.293; 29 -0.4,4.293; 30 -1.2,4.293; 31 -2,4.293; 32 -2.8,4.293
TQFP32-08 = smd 1.27 x 0.508: 1 -4.293,2.8; 2 -4.293,2; 3 -4.293,1.2; 4 -4.293,0.4; 5 -4.293,-0.4; 6 -4.293,-1.2; 7 -4.293,-2; 8 -4.293,-2.8; 17 4.293,-2.8; 18 4.293,-2; 19 4.293,-1.2; 20 4.293,-0.4; 21 4.293,0.4; 22 4.293,1.2; 23 4.293,2; 24 4.293,2.8 | smd 0.508 x 1.27: 9 -2.8,-4.293; 10 -2,-4.293; 11 -1.2,-4.293; 12 -0.4,-4.293; 13 0.4,-4.293; 14 1.2,-4.293; 15 2,-4.293; 16 2.8,-4.293; 25 2.8,4.293; 26 2,4.293; 27 1.2,4.293; 28 0.4,4.293; 29 -0.4,4.293; 30 -1.2,4.293; 31 -2,4.293; 32 -2.8,4.293
TSSOP20 = smd 1 x 0.4: 1 -2.937,2.693; 2 -2.937,2.032; 3 -2.937,1.372; 4 -2.937,0.712; 5 -2.937,0.051; 6 -2.937,-0.609; 7 -2.937,-1.27; 8 -2.943,-1.93; 9 -2.937,-2.59; 10 -2.937,-3.251; 11 2.905,-3.251; 12 2.905,-2.59; 13 2.911,-1.93; 14 2.905,-1.27; 15 2.905,-0.609; 16 2.905,0.051; 17 2.905,0.712; 18 2.905,1.372; 19 2.905,2.032; 20 2.905,2.693
MSOP8 = smd 1.45 x 0.45: 1 -2.2,0.975; 2 -2.2,0.325; 3 -2.2,-0.325; 4 -2.2,-0.975; 5 2.2,-0.975; 6 2.2,-0.325; 7 2.2,0.325; 8 2.2,0.975
2X03 = drill 1.016 octagon: 1 -2.54,-1.27; 2 -2.54,1.27; 3 0,-1.27; 4 0,1.27; 5 2.54,-1.27; 6 2.54,1.27
NRJ6HF-1 = drill 1.5 round: G -4.2,-5.91; R 7.23,0.44; RN -4.2,0.44; S 7.23,-5.91; T 7.23,6.79; TN -4.2,6.79 | hole 2: 7.23,-2.71; -4.2,-2.71 | hole 3: 5.1,3.64
0805 = smd 1.2 x 1: 1 -1.1,0; 2 1.1,0
SWITCH-SPDT = drill 1.5 pad 2.54 round: 1 0,4.699; 2 0,0; 3 0,-4.699
CHIP-LED0805 = smd 1.2 x 1.2: A 0,-1.05; C 0,1.05
TACTILE-PTH = drill 1.016 pad 1.88 round: 1 -3.251,2.261; 2 3.251,2.261; 3 -3.251,-2.261; 4 3.251,-2.261
SJ_3 = smd 0.635 x 1.27: 1 -0.889,0; 2 0,0; 3 0.889,0
SQFP-S-20X20-144 = smd 0.3 x 1.6: 1 -8.75,-10.6; 2 -8.25,-10.6; 3 -7.75,-10.6; 4 -7.25,-10.6; 5 -6.75,-10.6; 6 -6.25,-10.6; 7 -5.75,-10.6; 8 -5.25,-10.6; 9 -4.75,-10.6; 10 -4.25,-10.6; 11 -3.75,-10.6; 12 -3.25,-10.6; 13 -2.75,-10.6; 14 -2.25,-10.6; 15 -1.75,-10.6; 16 -1.25,-10.6; 17 -0.75,-10.6; 18 -0.25,-10.6; 19 0.25,-10.6; 20 0.75,-10.6; 21 1.25,-10.6; 22 1.75,-10.6; 23 2.25,-10.6; 24 2.75,-10.6; 25 3.25,-10.6; 26 3.75,-10.6; 27 4.25,-10.6; 28 4.75,-10.6; 29 5.25,-10.6; 30 5.75,-10.6; 31 6.25,-10.6; 32 6.75,-10.6; 33 7.25,-10.6; 34 7.75,-10.6; 35 8.25,-10.6; 36 8.75,-10.6; 73 8.75,10.6; 74 8.25,10.6; 75 7.75,10.6; 76 7.25,10.6; 77 6.75,10.6; 78 6.25,10.6; 79 5.75,10.6; 80 5.25,10.6; 81 4.75,10.6; 82 4.25,10.6; 83 3.75,10.6; 84 3.25,10.6; 85 2.75,10.6; 86 2.25,10.6; 87 1.75,10.6; 88 1.25,10.6; 89 0.75,10.6; 90 0.25,10.6; 91 -0.25,10.6; 92 -0.75,10.6; 93 -1.25,10.6; 94 -1.75,10.6; 95 -2.25,10.6; 96 -2.75,10.6; 97 -3.25,10.6; 98 -3.75,10.6; 99 -4.25,10.6; 100 -4.75,10.6; 101 -5.25,10.6; 102 -5.75,10.6; 103 -6.25,10.6; 104 -6.75,10.6; 105 -7.25,10.6; 106 -7.75,10.6; 107 -8.25,10.6; 108 -8.75,10.6 | smd 1.6 x 0.3: 37 10.6,-8.75; 38 10.6,-8.25; 39 10.6,-7.75; 40 10.6,-7.25; 41 10.6,-6.75; 42 10.6,-6.25; 43 10.6,-5.75; 44 10.6,-5.25; 45 10.6,-4.75; 46 10.6,-4.25; 47 10.6,-3.75; 48 10.6,-3.25; 49 10.6,-2.75; 50 10.6,-2.25; 51 10.6,-1.75; 52 10.6,-1.25; 53 10.6,-0.75; 54 10.6,-0.25; 55 10.6,0.25; 56 10.6,0.75; 57 10.6,1.25; 58 10.6,1.75; 59 10.6,2.25; 60 10.6,2.75; 61 10.6,3.25; 62 10.6,3.75; 63 10.6,4.25; 64 10.6,4.75; 65 10.6,5.25; 66 10.6,5.75; 67 10.6,6.25; 68 10.6,6.75; 69 10.6,7.25; 70 10.6,7.75; 71 10.6,8.25; 72 10.6,8.75; 109 -10.6,8.75; 110 -10.6,8.25; 111 -10.6,7.75; 112 -10.6,7.25; 113 -10.6,6.75; 114 -10.6,6.25; 115 -10.6,5.75; 116 -10.6,5.25; 117 -10.6,4.75; 118 -10.6,4.25; 119 -10.6,3.75; 120 -10.6,3.25; 121 -10.6,2.75; 122 -10.6,2.25; 123 -10.6,1.75; 124 -10.6,1.25; 125 -10.6,0.75; 126 -10.6,0.25; 127 -10.6,-0.25; 128 -10.6,-0.75; 129 -10.6,-1.25; 130 -10.6,-1.75; 131 -10.6,-2.25; 132 -10.6,-2.75; 133 -10.6,-3.25; 134 -10.6,-3.75; 135 -10.6,-4.25; 136 -10.6,-4.75; 137 -10.6,-5.25; 138 -10.6,-5.75; 139 -10.6,-6.25; 140 -10.6,-6.75; 141 -10.6,-7.25; 142 -10.6,-7.75; 143 -10.6,-8.25; 144 -10.6,-8.75
SJ = smd 1.168 x 1.6: 1 -0.762,0; 2 0.762,0
VACOLOCO_EVUF = drill 2.2 round: CASE1 -4.572,7.112; CASE2 4.572,7.112 | drill 1.016 pad 1.778 square: CCW -2.54,0 | drill 1.016 pad 1.778 round: CW 2.54,0; WIPER 0,0
SOT223 = smd 1.219 x 2.235: 1 -2.311,-3.099; 2 0,-3.099; 3 2.311,-3.099 | smd 3.6 x 2.2: 4 0,3.099
PN61729 = drill 0.95 octagon: 1 1.25,4.71; 2 -1.25,4.71; 3 -1.25,2.71; 4 1.25,2.71 | drill 2.2 round: P$1 -6,0; P$2 6,0
RESONATOR = smd 0.7 x 2: 1 -1,0; 2 0,0; 3 1,0
CT/CN0603 = smd 1 x 1: 1 -1,0; 2 1,0

### Placement (x,y rotation side)
9VDC_POWER  1,65 270 top
15K  68,30 270 top
22K  63,27 270 top
C1  35,76 90 top
C2  39,76 90 top
C3  23,75 270 top
C4  96,69 0 top
C5  29,38 180 top
C6  96,55 180 top
C7  22,42 0 top
C8  85,35 0 top
C9  85,26 0 top
C10  95,30 180 top
C11  95,22 180 top
C12  87,18 0 top
C13  97,43 270 top
C14  93,43 270 top
C15  96,59 180 top
C16  17,34 0 top
C17  96,63 180 top
C18  17,38 0 top
C19  43,30 270 top
C20  40,30 270 top
C21  58,27 90 top
C22  36,64 180 top
C23  35,69 270 top
C24  39,69 270 top
C25  22,63 270 top
C26  59,20 270 top
D2  18,72 270 top
F2  22,46 180 top
IC1  83,66 0 top
IC2  19,24 270 top
IC3  84,43 0 top
IC4  92,35 0 top
ICSP  60,75 180 top
ICSP1  5,12 90 top
J4-AUDIO  73,12 0 top
L1  22,56 0 top
POWER  8,75 90 top
R1  44,64 180 top
R2  23,34 0 top
R3  3,30 0 top
R4  26,17 0 top
R5  33,53 90 top
R6  80,35 180 top
R7  80,30 180 top
R8  85,30 180 top
R9  90,26 180 top
R10  95,26 180 top
R11  85,22 0 top
R12  95,18 0 top
R13  3,34 0 top
R14  3,38 0 top
R15  28,53 90 top
R16  64,63 90 top
R17  32,24 180 top
R18  32,27 180 top
R19  68,68 90 top
R20  85,77 90 top
R21  81,77 270 top
R22  77,77 270 top
R23  36,60 180 top
R24  73,58 0 top
R25  63,20 270 top
R26  73,51 180 top
R27  73,54 180 top
RX  8,38 90 top
RX1  8,30 90 top
S1  49,75 0 top
S2  5,23 270 top
SJ1  23,69 90 top
SJ2  75,35 90 top
SJ3  75,30 90 top
TX  8,34 90 top
U$1  53,46 180 top
U$2  53,20 0 top
UBOOT  29,42 180 top
VOLUME  92,13 180 top
VOLUME1  57,13 180 top
VOLUME2  43,13 180 top
VOLUME3  29,13 180 top
VOLUME4  15,13 180 top
VREG  29,75 180 top
VREG1  29,64 180 top
X3  11,49 270 top
Y1  44,68 0 top
Y2  23,38 180 top
Y3  64,68 270 top
Y4  68,63 270 top
Z1  22,53 0 top
Z2  22,50 0 top

### Tracks (layer width: path | path; a pad name or v marks a point on that pad's centre or on a via)
+1V8  (via drill 0.5, 0.6)
  Top 0.305: 54.25,59.75 U$1.16 54.25,61.75 | U$1.2 61.25,59.75 | 49,48.25 49.75,48.25 v50,48 | 49,48.25 U$1.50 | v50,41 50.75,40.25 U$1.86 | 46,51.25 U$1.44 | 49,48.25 46,51.25 | 46,51.25 45.25,52 U$1.34 45.25,61.25 46,62 48,62 | 48,62 48.75,61.25 U$1.27 | 54.25,61.75 54,62 48,62 | U$1.2 61.25,61.75 61,62 54.5,62 54.25,61.75 | v58,45 58.25,45.25 U$1.125 | U$1.2 61.25,54.25 60,53 v56,53
  Bottom 0.406: v50,41 v50,48 | v56,53 56,46 57,45 v58,45
+3V3  (via drill 0.5)
  Top 0.305: R24.1 71,58 70,57 70,54 68.25,52.25 U$1.139 61.95,52.25 60.7,51 55,51 53.75,52.25 | C19.1 43,32 44.25,33.25 U$1.73 44.25,39.25 45,40 49,40 | 53.75,52.25 53.75,48.75 53,48 | 53,48 v52,47 49,47 48.25,47.75 U$1.51 37.75,47.75 v37,48.5 | U$1.104 59.75,41.25 59,42 v52,42 49.6,42 49,41.4 49,40 | U$1.85 50.25,38.75 49,40 | U$1.3 60.75,54.75 60,54 54.75,54 53.75,53 | 53.75,52.25 53.75,53 | 53.75,53 U$1.17 | U$1.40 37.55,53.25 v37,52.7 | U$1.127 59.75,46.25 58,48 53,48
  Top 0.406: 29,61 VREG1.4 v29,59 29,58 31,56 v36,56 | SJ1.1 26.11,65 28,65 29,66 VREG1.2 v29,69 29.85,69.85 C23.1 35.15,70 37,70 37.5,70.5 C24.+ | C19.1 42.15,30.85 41.5,31.5 C20.+
  Bottom 0.406: v36,56 37,55 v37,52.7 v37,48.5 | v52,42 v52,47 | v29,59 v29,69
+5V  (via drill 0.5)
  Top 0.406: SJ1.3 24.89,69.89 v26.5,71.5 26.9,71.9 VREG.4 29,72 | 29,78 VREG.2 28,77.1 v28,76 | v31,75 34.85,75 C1.1 36.85,75.15 37.5,74.5 C2.+
  Bottom 0.406: v26.5,71.5 29,74 29,75 v28,76 30,76 v31,75
ANTI_ALIAS_OUT
  Top 0.406: R12.1 C12.- 88.5,15.5 89.46,14.54 VOLUME.CW
AREF
  Top 0.406: IC1.20 94.6,65.6 95.15,66.15 C4.1
D+  (via drill 0.5)
  Top 0.305: U$1.37 v31.5,54.75 30.75,54.75 29.85,53.85 R15.2
  Top 0.406: X3.3 13.71,50.71 16,53 Z1.1 22,54 26,54 26.15,53.85 R15.2 | R17.1 v34,24
  Bottom 0.406: v34,24 34,48 32,50 32,54.25 v31.5,54.75
D-  (via drill 0.5)
  Top 0.305: U$1.38 35.25,54.25 34.85,53.85 R5.2
  Top 0.406: X3.2 19.75,50.25 20,50 Z2.1 21,51 22,52 25,52 27,50 v29,50 | v31,53 31.85,53.85 R5.2 | R18.1 33,27.15 v33,29
  Bottom 0.406: v31,53 31,52 v29,50 33,46 v33,29
DAC1_AB  (via drill 0.5)
  Top 0.305: v68,47 67.25,47.75 U$1.130
  Top 0.406: IC3.11 88.25,39.75 88.6,39.4 88.6,38.6 88,38 v79,38 | IC1.1 81.7,68.8 v82.5,68 | v78,47.5 77.5,47 v68,47
  Bottom 0.406: v79,38 78,37 75,37 68,44 v68,47 | v82.5,68 79,68 78,67 v78,47.5
DAC1_DB0  (via drill 0.5)
  Top 0.305: IC3.8 80.07,41.07 v77,38 76,37 70,37 69,36 67,36 65.75,37.25 U$1.109
  Top 0.406: IC1.23 90.9,68 v91.1,68.2
  Bottom 0.406: v77,38 92,53 92,57 91,58 91,68.1 v91.1,68.2
DAC1_DB1  (via drill 0.5)
  Top 0.305: U$1.111 75.25,38.25 v75.5,38.5 78.73,41.73 IC3.7
  Top 0.406: IC1.24 89.8,68.8 v90,69
  Bottom 0.406: v90,69 90,57 91,56 91,53 77,39 76,39 v75.5,38.5
DAC1_DB2  (via drill 0.5)
  Top 0.305: U$1.113 74.25,39.25 v74.5,39.5 77.39,42.39 IC3.6
  Top 0.406: IC1.25 85.8,70.8 87,72 v88,72 | v90,55 v88,57
  Bottom 0.406: v88,57 v88,72 | v74.5,39.5 75,40 77,40 90,53 v90,55
DAC1_DB3  (via drill 0.5)
  Top 0.305: U$1.115 73.25,40.25 v73.5,40.5 76.05,43.05 IC3.5
  Top 0.406: IC1.26 85,72 v87,74
  Bottom 0.406: v87,74 88,74 89,73 89,53 77,41 74,41 v73.5,40.5
DAC1_DB4  (via drill 0.5)
  Top 0.305: U$1.117 72.25,41.25 v72.5,41.5 74.71,43.71 IC3.4
  Top 0.406: IC1.2 81,68 v83,66
  Bottom 0.406: v72.5,41.5 73,42 77,42 85,50 85,64 v83,66
DAC1_DB5  (via drill 0.5)
  Top 0.305: U$1.119 71.25,42.25 v71.5,42.5 73.37,44.37 IC3.3
  Top 0.406: v82,49 v80,49 | IC1.9 80.2,60.7 80,60.5 v80,59
  Bottom 0.406: v71.5,42.5 72,43 77,43 82,48 v82,49 | v80,49 v80,59
DAC1_DB6  (via drill 0.5)
  Top 0.305: U$1.121 70.25,43.25 v70.5,43.5 72.03,45.03 IC3.2
  Top 0.406: v81,60 IC1.10
  Bottom 0.406: v70.5,43.5 71,44 77,44 81,48 v81,60
DAC1_DB7  (via drill 0.5)
  Top 0.305: U$1.123 69.25,44.25 v69.5,44.5 70.69,45.69 IC3.1
  Top 0.406: v79,57 80,58 81,58 82,59 82,60.5 81.8,60.7 IC1.11
  Bottom 0.406: v69.5,44.5 70,45 77,45 79,47 v79,57
DAC1_VOUTA  (via drill 0.5)
  Top 0.406: IC3.19 86.94,45 v90,45 | v91,37 78,37 76.89,35.89 SJ2.3
  Bottom 0.406: v90,45 91,44 v91,37
DAC1_VOUTB  (via drill 0.5)
  Top 0.406: IC3.18 88.63,44.37 v89,44 | v77,31 76.89,30.89 SJ3.3
  Bottom 0.406: v89,44 89,40 80,31 v77,31
DAC1_WR  (via drill 0.5)
  Top 0.305: U$1.128 66.25,46.75 v67,46
  Top 0.406: v80,39 80.75,39.75 IC3.10 | IC1.32 80.2,70.8 80,71 78,71 v77,70 | v67,46 v69,46
  Bottom 0.406: v67,46 67,44 75,36 79,36 80,37 v80,39 | v77,70 77,47 76,46 v69,46
DAC2_CS  (via drill 0.5)
  Top 0.305: U$2.2 49.67,20.32 49,21 49,22 55.25,28.25 U$1.95 55.25,32.75 56,32 v64,32
  Top 0.406: v84,51 80,51 77,48 v69,48 | IC1.14 84.2,58.2 v84,58
  Bottom 0.406: v84,51 v84,58 | v69,48 67,48 65,46 65,33 v64,32
DAC2_LDAC  (via drill 0.5)
  Top 0.305: v54.25,30.25 U$1.93
  Top 0.406: U$2.5 55.98,19.02 58,17 v60,17 | IC1.13 83.4,59.4 v83,59 | v83,52 79,52 76,49 v71,49
  Bottom 0.406: 55,30 60,25 v60,17 | v83,52 v83,59 | v71,49 67,49 64,46 64,34 63,33 63,31 62,30 55,30 | 55,30 54.5,30 v54.25,30.25
DAC2_VOUT
  Top 0.406: U$2.8 55.98,20.98 57,22 64,22 75,33 SJ2.1
DTR  (via drill 0.5)
  Top 0.406: UBOOT.1 29.76,40.76 28.15,39.15 C5.2 v26,38 | v12,24 12.4,23.6 IC2.13
  Bottom 0.406: v26,38 13,38 12,37 v12,24
FWUP
  Top 0.305: U$1.135 68.25,50.25 70,52 70,53 71,54 71,55 72,56 73,56 73.85,56.85 R24.2
GND  (via drill 0.5, 0.6)
  Top 0.305: v45.25,29.25 U$1.75 | U$1.43 39.75,51.75 38,50 v34,50 34,49 | U$1.90 52.75,29.25 v52.5,29 | v68,54 66.75,52.75 U$1.140 60.75,52.75 60,52 v58,52 | U$1.60 40.25,43.25 39,42 | 39,42 v39,41 | U$1.33 45.75,59.75 v47,61 | U$1.18 53.25,59.75 v52,61 | U$1.52 35.75,47.25 34,49 | 34,49 32,49 29,46 29,45 30,44 34,44 36,42 39,42 | U$1.126 59.25,45.75 58,47 v57,47
  Top 0.406: C25.- v17,61.5 14.5,61.5 11,65 9VDC_POWER.GND | C23.2 32.15,68.15 31.31,67.31 VREG1.1 31.31,65.31 30,64 26,64 23.5,61.5 C25.- | ICSP1.6 3.73,18.76 S2.4 S2.3 2.15,26.84 R3.1 | C3.- 24.5,73.5 26,75 29,75 31.31,77.31 VREG.1 32.9,78.1 34.15,76.85 C1.2 35.15,77 37,77 37.5,77.5 C2.- 40.5,77.5 41,77 41,72 42,71 | C23.2 35.15,68 37,68 37.5,67.5 C24.- 40.5,67.5 41,68 41,70 42,71 | C23.2 35,66 35.15,65.85 C22.2 R23.2 v34,60 | 44,70 Y1.2 | 42,71 43,71 44,70 | 44,70 45,71 45,71.99 S1.3 S1.4 53.24,73.73 ICSP.6 61,70.19 61,69 62,68 Y3.2 v66,68 | IC1.18 92,64 93,63 C17.2 | C4.2 96.85,65.85 95.15,64.15 C17.2 | C17.2 C15.2 95,58.85 95,57 94.5,56.5 C6.- 94.5,53.5 | C13.2 95.15,42.15 94.5,41.5 C14.- v90,41.5 89.5,41.5 89.07,41.07 IC3.13 | J4-AUDIO.S 83.14,9 93,9 94.54,10.54 VOLUME.CCW 94.54,14.54 95.85,15.85 R12.2 95.85,19.15 94.15,20.85 C11.2 90,22 88,24 88,25 87,26 C9.2 85.85,26.85 v87,28 | X3.4 13.71,47.29 19,42 | 19,42 C7.1 21.15,40.85 23,39 | C25.- 22,60 21,59 21,56.1 L1.1 | IC3.9 83.41,40.41 84.07,41.07 IC3.13 | IC4.4 89.03,34.02 v88,33 | v66,63 Y4.2 70,63 71,62 v74,62 77,59 77,57 79,55 84,55 86,53 94,53 94.5,53.5 | 22K.1 C21.2 56.85,27.85 v56,27 | C26.1 57.55,20.85 v57.5,20.8 57.02,20.32 U$2.7 | VOLUME2.CCW 45.54,16.46 42,20 42,28 41.5,28.5 | 19,42 19,39 18.85,39 C18.2 17.85,36.15 18.5,35.5 C16.- 20.2,32.3 IC2.3 20.2,24.8 21.4,23.6 IC2.28 28.4,23.6 v31.54,20.46 | 23,39 Y2.2 | UBOOT.2 26,42 23,39 | IC3.13 84.93,41.07 84,42 84,43 | 84,43 84,45 84.69,45.69 IC3.20 88.69,45.69 89,46 v95,46 | IC3.17 84.71,43.71 84,43 | VOLUME4.CCW 19.54,15 29.54,15 VOLUME3.CCW | 41.5,28.5 C20.- 40,27 v39,26
  Top 0.406: 41.5,28.5 42.15,29.15 C19.2 45.15,29.15 v45.25,29.25 | IC1.3 74.2,67.2 v74,67 75.4,65.6 IC1.5 | 94.5,53.5 v95,53 | v47,63 v52,63
  Bottom 0.406: X3.4 13.71,48.29 12,50 12,52 14,54 14,58.5 v17,61.5 | v90,41.5 90,38 88,36 v88,33 88,29 v87,28 | v66,68 v66,63 66,62 68,60 v68,54 | ICSP1.6 2,12.81 2,8 3,7 7,7 10,10 16,10 17.54,11.54 VOLUME4.CCW | VOLUME3.CCW v31.54,20.46 | v34,50 v34,60 37,63 v47,63 v47,61 | v45.25,29.25 45.5,29 v52.5,29 54,29 v56,27 57.5,25.5 v57.5,20.8 57.5,17.5 59.54,15.46 VOLUME1.CCW | v95,53 v95,46 | v39,41 v39,26 | v52,63 v52,61 | v74,62 v74,67 | v58,52 58,48 v57,47
  pour Top (isolate 0.508): 0,80 100,80 100,0 0,0
  pour Bottom (isolate 0.508): 0,80 100,80 100,0 0,0
M8RXD  (via drill 0.5)
  Top 0.406: R21.1 79.85,77.85 v79,77 | R26.1 75,51 v75.5,51.5 | IC2.9 13.2,26.8 13,27 13,29 14,30 v15,30 | v26,30 27,31 v38,31 | v45,43 v60,43
  Bottom 0.406: v79,77 76,74 76,52 v75.5,51.5 75,51 63,51 62,50 62,45 v60,43 | v15,30 v26,30 | v38,31 38,42 39,43 v45,43
M8TXD  (via drill 0.5)
  Top 0.406: R22.1 75.85,77.85 v75,77 | v75,54 R27.1 | IC2.8 16.2,30.2 v17,31 | v26,32 v37,32 | v47,44 v59,44
  Bottom 0.406: v75,77 v75,54 75,53 74,52 62,52 61,51 61,46 v59,44 | v17,31 25,31 v26,32 | v37,32 37,43 38,44 v47,44
MISO1  (via drill 0.5)
  Top 0.406: ICSP.1 73.73,76.27 v77,73 | v86,57 85.8,57.2 IC1.16
  Bottom 0.406: v77,73 78,72 84,72 86,70 v86,57
MISO2  (via drill 0.5)
  Top 0.406: v12,15 15,15 16.2,16.2 IC2.17
  Bottom 0.406: ICSP1.1 7.46,9.46 11,13 11,14 v12,15
MOSI1  (via drill 0.5)
  Top 0.305: U$2.4 48.98,19.02 47,21 47,22 51.5,26.5 51.5,29.4 51.75,29.65 U$1.88 51.75,37.75 v53,39
  Top 0.406: ICSP.4 62.73,71 77,71 v79,73 | v86,55 85,56 IC1.15
  Bottom 0.406: v53,39 53,70 54,71 59,71 60,72 ICSP.4 | v86,55 87,56 87,71 85,73 v79,73
MOSI2  (via drill 0.5)
  Top 0.406: ICSP1.4 5.03,13.3 9.3,13.3 v10,14 | v11,20 12.2,21.2 IC2.16
  Bottom 0.406: v10,14 10,19 v11,20
N$1
  Top 0.305: U$1.41 38.55,52.75 37.6,51.8 34.4,51.8 34,52.2 33.05,52.2 R5.1
N$2
  Top 0.305: U$1.42 39.25,52.25 38,51 31,51 29.85,52.15 R15.1
N$3
  Top 0.406: R14.2 RX.C
N$4
  Top 0.406: R13.2 TX.C
N$5  (via drill 0.5)
  Top 0.305: U$1.39 35.75,53.75 v35,53
  Top 0.406: C22.1 R23.1 36.85,58.85 v36,58
  Bottom 0.406: v35,53 35,57 v36,58
N$6
  Top 0.406: R3.2 RX1.C
N$7
  Top 0.305: U$1.133 69.25,49.25 71,51 R26.2
N$8
  Top 0.406: IC1.30 81.8,73.2 81,74 R21.2
N$9
  Top 0.406: IC1.31 81,73 80,74 78,74 77,75 R22.2
N$10
  Top 0.305: U$1.134 68.75,49.75 71,52 71,53 72,54 R27.2
N$15
  Top 0.406: U$2.6 56.92,19.68 57.45,19.15 C26.2 60.15,19.15 61.85,20.85 R25.1
N$21
  Top 0.406: R11.1 84.15,20.85 85.5,19.5 C12.+
N$25
  Top 0.406: 9VDC_POWER.PWR 16,65 18,67 D2.A
N$27
  Top 0.406: POWER.2 10,77 20,77 20.5,76.5 C3.+ 24.6,78.1 VREG.3
N$42
  Top 0.406: POWER.3 15,75 16,74 17.8,74 D2.C
N$69
  Top 0.406: R6.1 C8.1 R8.2 R7.1
N$71
  Top 0.406: C9.1 84.15,27.15 85.85,28.85 R8.1 85.85,31.85 87,33 87,34 87.67,34.67 IC4.3
N$73
  Top 0.406: R9.1 R10.2 94.15,27.15 95.85,28.85 C10.1
N$74
  Top 0.406: C11.1 R10.1 98,28.15 98,33 96.97,34.02 IC4.5
POT1  (via drill 0.5)
  Top 0.305: v31,45 32.75,46.75 U$1.53 48.25,46.75 v49,46
  Top 0.406: v24,19 v30,19 | v50,68 v55,68 | v87,76 84.2,73.2 IC1.27
  Bottom 0.406: v31,45 31,22 30,21 v30,19 | VOLUME4.WIPER 13,15 13,17 14,18 23,18 v24,19 | v49,46 49,67 v50,68 | v55,68 56,69 61,69 71,79 82,79 83,78 83,77 84,76 v87,76
POT2  (via drill 0.5)
  Top 0.305: v35,45 35.75,45.75 U$1.55 47.25,45.75 48,45 v55,45
  Top 0.406: VOLUME2.WIPER 41,15 v35,15 | IC1.28 83.4,67.6 v84,67 | v82,53 78.5,53 v75.5,50 | v55,41 v58,41
  Bottom 0.406: v35,15 v35,45 | v84,67 82.7,67 82,66.3 v82,53 | v75.5,50 64,50 63,49 63,44 60,41 v58,41 | v55,45 v55,41
POT3  (via drill 0.5)
  Top 0.305: U$1.57 36.75,44.75 v36,44
  Top 0.406: VOLUME3.WIPER 31,11 34,11 v36,13 | IC1.19 93.2,64.8 v94,64 | v43,22 49,16 63,16 71,24 v86,24
  Bottom 0.406: v36,13 36,23 | 36,23 v36,44 | v94,64 94,47 92,45 92,36 91,35 91,26 89,24 v86,24 | v43,22 37,22 36,23
POT4  (via drill 0.5)
  Top 0.305: U$1.79 47.25,23.25 46,22 46,21 49,18 v55,18
  Top 0.406: IC1.22 92.2,67.2 v93,68 | v65,16 75,16 78,19 78,20 79,21 82,21 v83,20
  Bottom 0.406: v55,18 57,16 VOLUME1.WIPER 59,11 63,11 65,13 v65,16 | v93,68 95,66 95,55 96,54 96,35 93,32 93,24 89,20 v83,20
RD+
  Top 0.406: IC2.29 28.6,24.4 29,24 R17.2
RD-
  Top 0.406: IC2.30 28.2,25.2 30,27 R18.2
RESET1  (via drill 0.5)
  Top 0.406: S1.1 S1.2 53.24,76.27 ICSP.5 60.19,79 82,79 83,78 83,74 | IC1.29 82.6,73.6 83,74 | 83,74 84,74 85,75 R20.1 | 30,38 C5.1 29.85,36.15 v30,36
  Bottom 0.406: S1.1 44,75.51 44,72 33,61 33,58 28,53 28,49 30,47 v30,36
RESET2  (via drill 0.5)
  Top 0.406: S2.2 6.27,18.76 ICSP1.5 | S2.2 S2.1 | R4.1 23,17 21.8,18.2 IC2.24 21.8,16.8 v21,16 | S2.2 11.01,16 v14,16
  Bottom 0.406: v14,16 v21,16
RXLED  (via drill 0.5)
  Top 0.406: IC2.10 12,26 v11,27 | v7,36 3,36 2.15,36.85 R14.1
  Bottom 0.406: v11,27 11,32 v7,36
SCK1  (via drill 0.5)
  Top 0.305: U$2.3 49.33,19.68 48,21 48,22 53.6,27.6 53.6,29.5 53.25,29.85 U$1.91 53.25,37.25 v54,38
  Top 0.406: ICSP.3 61.27,75 v73,75 | v92,62 90.8,63.2 IC1.17
  Bottom 0.406: v54,38 54,69 55,70 60,70 61.3,71.3 61.3,74.97 ICSP.3 | v73,75 73,77 74,78 80,78 81,77 81,76 82,75 89,75 92,72 v92,62
SCK2  (via drill 0.5)
  Top 0.406: v9,21 10,22 IC2.15
  Bottom 0.406: ICSP1.3 8,12 9,13 v9,21
STAGE1_IN1
  Top 0.406: SJ2.2 R6.2
STAGE1_IN2
  Top 0.406: SJ3.2 R7.2
STAGE1_OUT  (via drill 0.5)
  Top 0.406: 87.33,35.33 87,35 C8.2 85.85,33.45 v85.5,33.1 | 87.33,35.33 IC4.2 | IC4.1 87.97,35.98 87.33,35.33 | R9.2 89,26.15 v89,28
  Bottom 0.406: v89,28 89,27 88,26 87,26 85.5,27.5 v85.5,33.1
STAGE2_OUT  (via drill 0.5)
  Top 0.406: IC4.6 97.67,34.67 v98,35 97.67,35.33 IC4.7 | C10.2 94,30 94,31 v94.5,31.5 | v92,21 89,21 88,22 R11.2
  Bottom 0.406: v98,35 v94.5,31.5 94,31 94,23 v92,21
TXLED  (via drill 0.5)
  Top 0.406: IC2.11 10.8,25.2 v10,26 | v7,32 3,32 2.15,32.85 R13.1
  Bottom 0.406: v10,26 10,29 v7,32
USBVCC  (via drill 0.5)
  Top 0.406: IC2.31 26,26 v27,27 | v26,46 F2.1 | v66,30 66.85,30.85 15K.1 | v26,10 27,9 v63,9
  Bottom 0.406: v26,46 27,45 v27,27 27,19 25,17 25,11 v26,10 | v66,30 66,12 v63,9
USHIELD  (via drill 0.5)
  Top 0.406: X3.P$1 22.1,55 L1.2 v25,56 | v25,50 Z2.2 | v25,53 Z1.2
  Bottom 0.406: X3.P$2 X3.P$1 | v25,56 v25,53 v25,50
VBUS
  Top 0.406: X3.1 16.25,47.75 18,46 F2.2
VBUS_DETECT  (via drill 0.5)
  Top 0.305: U$1.110 67.25,37.75 v68,37
  Top 0.406: C21.1 22K.2 67.15,26.15 68,27 15K.2 69.15,29.15 v70,30
  Bottom 0.406: v68,37 70,35 v70,30
VCC  (via drill 0.5)
  Top 0.406: VREG1.3 26.69,68.31 26,69 SJ1.2 21,69 20,68 v20,65 20.5,64.5 C25.+ | TX.A RX1.A | TX.A RX.A | C16.+ TX.A | C16.+ 15.5,35.5 16.15,36.15 C18.1 16.15,39.15 v17,40 | C13.1 97,53 97.5,53.5 C6.+ 97.5,56.5 97,57 97,58.85 C15.1 C17.1 96.85,63.85 98,65 98,71 97,72 95,72 94,73 | 90.05,43.05 IC3.16 | 90.05,43.05 91.5,44.5 C14.+ 94.5,44.5 95.15,43.85 C13.1 | 89.39,42.39 IC3.15 | 89.39,42.39 90.05,43.05 | 89.39,42.39 88.73,41.73 IC3.14 85.77,41.73 v85,42.5 | IC4.8 97.97,35.98 99,37 99,43 98.15,43.85 C13.1 | ICSP1.2 4.97,10.7 10.16,10.7 VOLUME4.CW 14.46,11 24.46,11 VOLUME3.CW 29.46,10 37.46,10 VOLUME2.CW 42.46,11 52.46,11 VOLUME1.CW 56.46,11 61,11 v63,13 | C16.+ 15.5,32.5 16,32 19,32 19.4,31.6 IC2.4 19.4,25.4 v19,25 | v29,30 28,30 24.8,26.8 IC2.32 21.8,26.8 v21.2,26.2 | v85,40 85.41,40.41 IC3.12 | 94,73 94,67 93.4,66.4 IC1.21 85.4,66.4 83.8,64.8 82,64.8 | 94,73 94,77 93.15,77.85 R20.2 | ICSP.2 64.27,72 v73,72 | v73,66 74.2,64.8 IC1.6 82,64.8 | R25.2 64.15,19.15 v65,20 65,21 v73,29 | IC1.4 80.4,66.4 82,64.8 | R4.2 28.7,17 v28.85,17.15
  Bottom 0.406: v17,40 18,41 18,58 20,60 v20,65 | VOLUME3.CW 26.46,14.76 v28.85,17.15 29,17.3 v29,30 | v85,42.5 v85,40 85,38 79,32 76,32 v73,29 | v19,25 20,25 v21.2,26.2 | v73,66 v73,72 | v63,13 63,18 v65,20
VOLUME_OUT
  Top 0.406: VOLUME.WIPER 92,12 91,11 85,11 80.23,15.77 J4-AUDIO.T
VUCAP  (via drill 0.5)
  Top 0.406: IC2.27 27.2,22.8 v28,22 | v28,44 26,44 24,42 C7.2
  Bottom 0.406: v28,22 v28,44
XTAL1
  Top 0.406: Y2.1 24,36 23.85,35.85 R2.2 23.85,32.85 21.8,30.8 IC2.1
XTAL2
  Top 0.406: Y2.3 22,36 22.15,35.85 R2.1 22.15,32.15 21,31 IC2.2
XTAL3
  Top 0.305: R1.2 43.15,61.85 44.25,60.75 U$1.36
  Top 0.406: R1.2 43.15,65.85 43,66 Y1.1
XTAL4
  Top 0.305: U$1.35 44.75,62.45 44.85,62.55 R1.1
  Top 0.406: R1.1 44.85,65.85 45,66 Y1.3
XTAL5
  Top 0.406: IC1.7 72.85,64 R19.2 66.75,68.85 66.6,69 Y3.1
XTAL6
  Top 0.406: IC1.8 72.8,63.2 68.85,67.15 R19.1 66.75,67.15 66.6,67 Y3.3
XTAL7  (via drill 0.5)
  Top 0.305: U$1.144 65.75,54.75 66,55 66,56 67,57 v69,57
  Top 0.406: v70,64 Y4.1 65,64 64.85,63.85 R16.2
  Bottom 0.406: v69,57 69,63 v70,64
XTAL8  (via drill 0.5)
  Top 0.305: U$1.143 66.25,54.25 v67,55
  Top 0.406: Y4.3 65,62 64.85,62.15 R16.1 v64,60
  Bottom 0.406: v67,55 67,59.15 66.15,60 v64,60